# Altium project STM32F103.PrjPcb
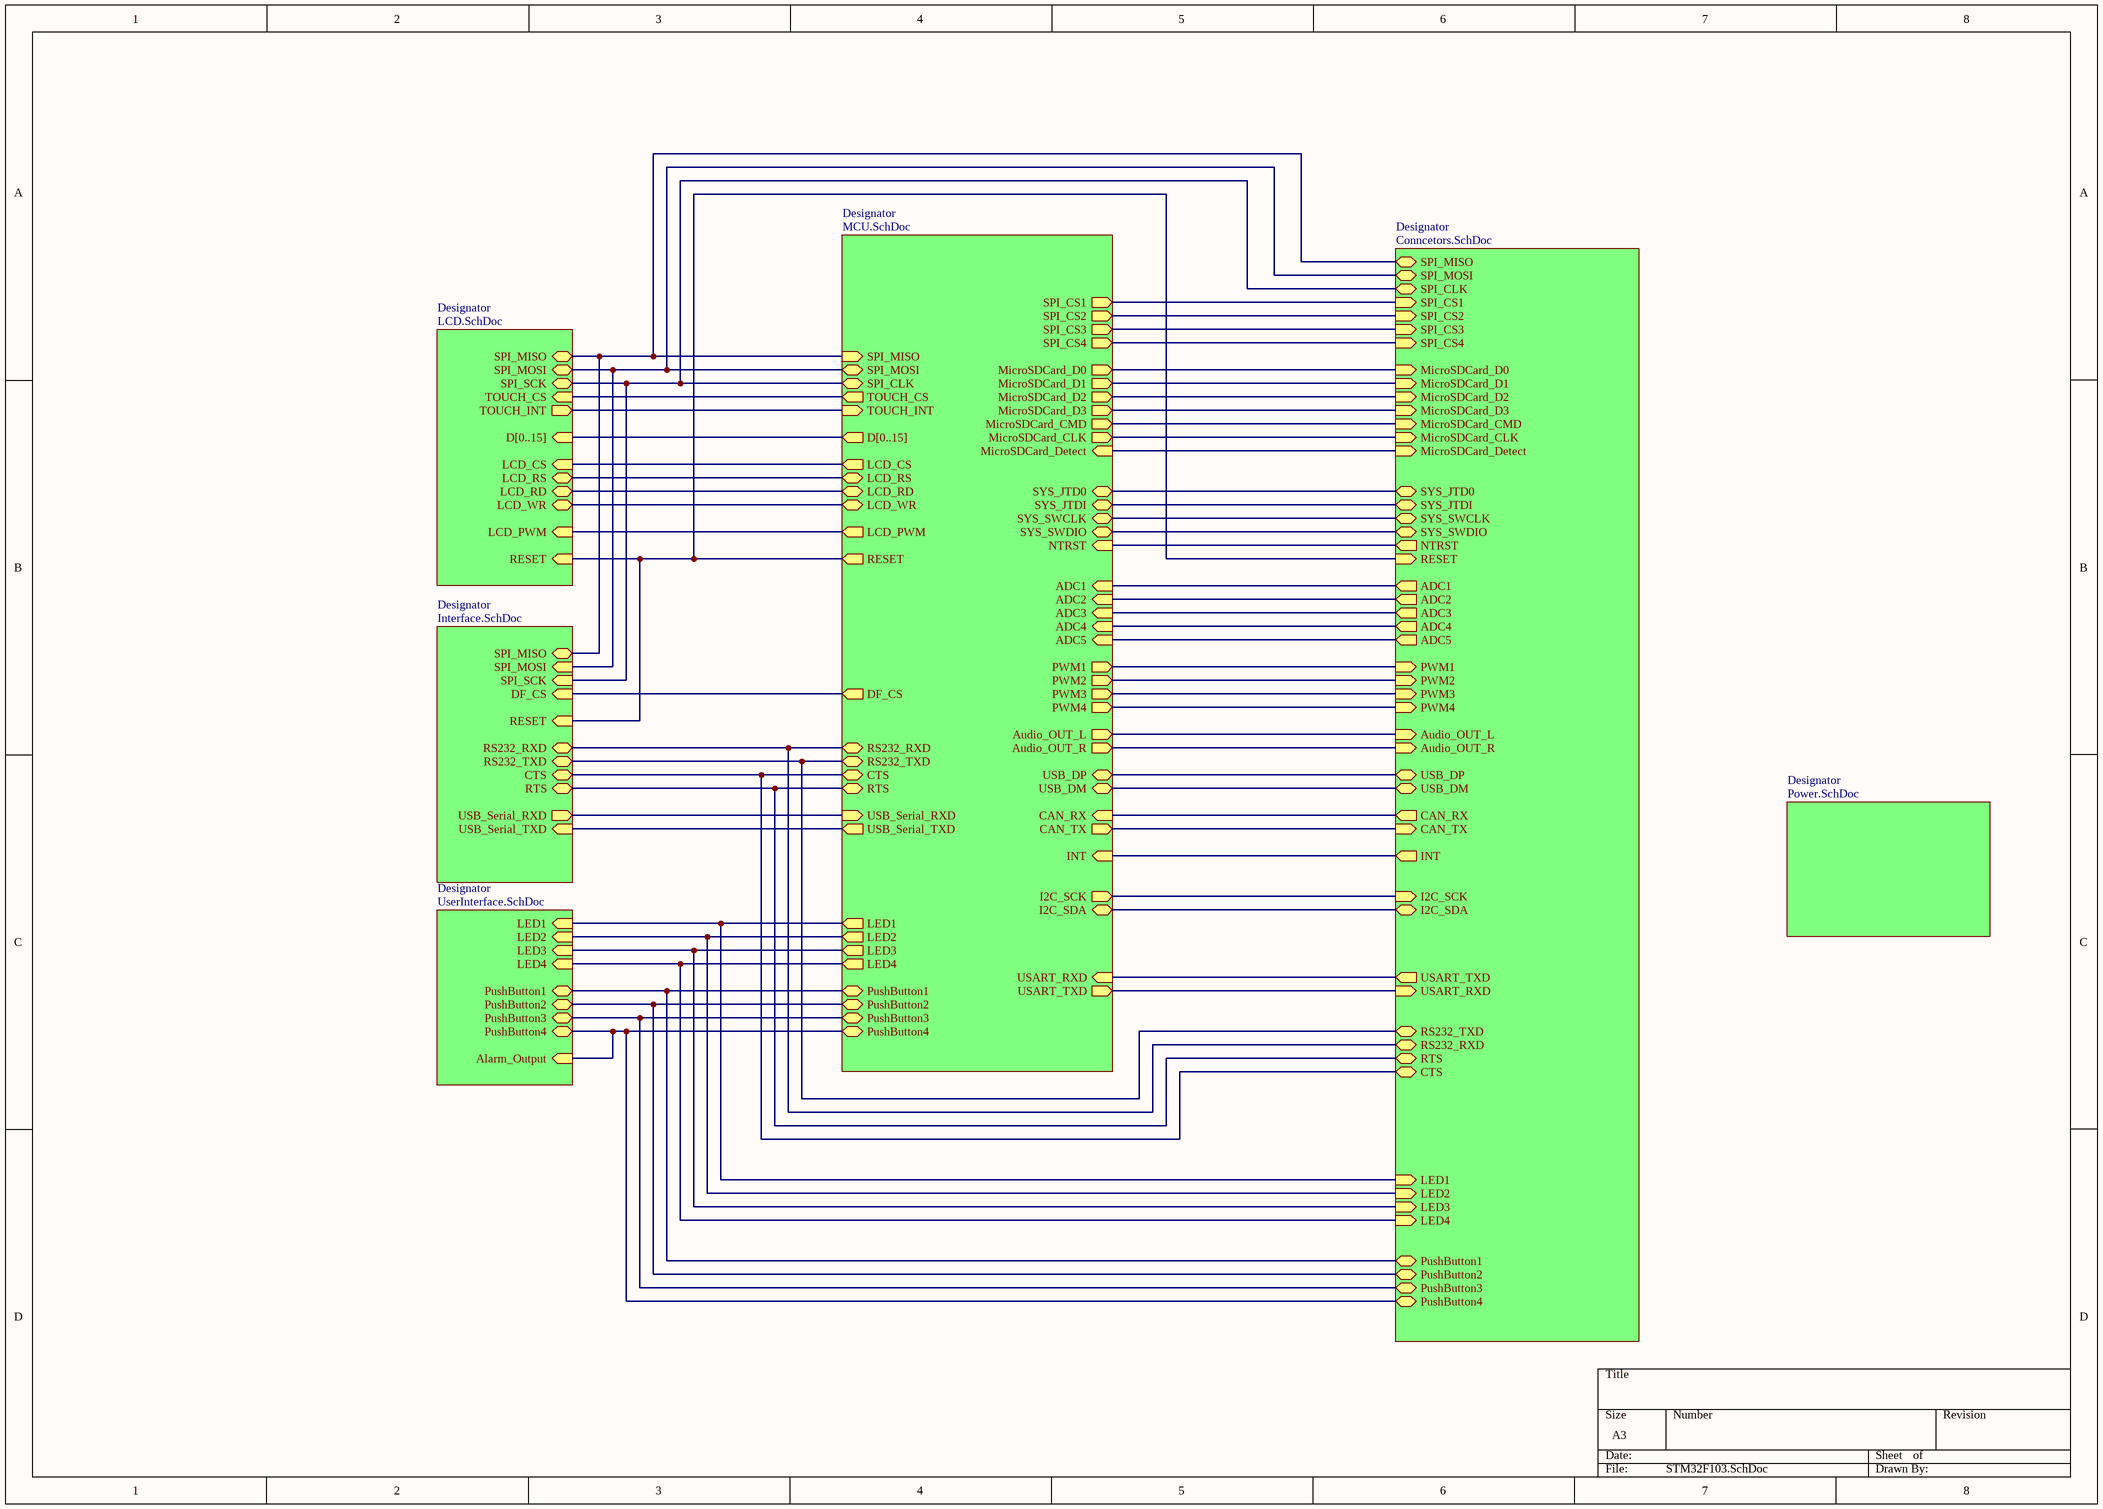
[diagram p0: STM32F103.SchDoc]
7 sheets, 148 parts. Net scope: hierarchical (ports join the sheet entries above them; power ports are global).
Board file: STM32F103.PcbDoc
Sheets:
  STM32F103.SchDoc
    Designator = MCU.SchDoc
    Designator = Power.SchDoc
    Designator = Conncetors.SchDoc
    Designator = Interface.SchDoc
    Designator = UserInterface.SchDoc
    Designator = LCD.SchDoc

## Sheet STM32F103.SchDoc
size A3

### Sub-sheets
Designator = MCU.SchDoc: D[0..15] (out), SPI_MISO (in), SPI_MOSI (bidir), SPI_CLK (bidir), TOUCH_CS (out), TOUCH_INT (in), LCD_CS (out), LCD_RS (bidir), LCD_RD (bidir), LCD_WR (bidir), LCD_PWM (out), RESET (out), DF_CS (out), RS232_RXD (bidir), RS232_TXD (bidir), CTS (bidir), RTS (bidir), USB_Serial_RXD (in), USB_Serial_TXD (out), LED1 (out), LED2 (out), LED3 (out), LED4 (out), PushButton1 (bidir), PushButton2 (bidir), PushButton3 (bidir), PushButton4 (bidir), I2C_SCK (out), I2C_SDA (bidir), USART_TXD (out), USART_RXD (in), INT (in), CAN_TX (out), CAN_RX (in), USB_DM (bidir), USB_DP (bidir), Audio_OUT_L (out), Audio_OUT_R (out), PWM1 (out), PWM2 (out), PWM3 (out), PWM4 (out), ADC1 (in), ADC2 (in), ADC3 (in), ADC4 (in), ADC5 (in), NTRST (in), SYS_SWDIO (bidir), SYS_SWCLK (bidir), SYS_JTDI (bidir), SYS_JTD0 (bidir), MicroSDCard_D0 (out), MicroSDCard_D1 (out), MicroSDCard_D2 (out), MicroSDCard_D3 (out), MicroSDCard_CMD (out), MicroSDCard_CLK (out), MicroSDCard_Detect (in), SPI_CS1 (out), SPI_CS2 (out), SPI_CS3 (out), SPI_CS4 (out)
Designator = Power.SchDoc: no entries
Designator = Conncetors.SchDoc: MicroSDCard_D0 (in), MicroSDCard_D1 (in), MicroSDCard_D2 (in), MicroSDCard_D3 (in), MicroSDCard_CMD (in), MicroSDCard_CLK (in), MicroSDCard_Detect (in), SYS_JTD0 (bidir), SYS_JTDI (bidir), SYS_SWCLK (bidir), SYS_SWDIO (bidir), NTRST (out), RESET (in), LED1 (in), LED2 (in), LED3 (in), LED4 (in), PushButton1 (bidir), PushButton2 (bidir), PushButton3 (bidir), PushButton4 (bidir), ADC1 (out), ADC2 (out), ADC3 (out), ADC4 (out), ADC5 (out), PWM1 (in), PWM2 (in), PWM3 (in), PWM4 (in), Audio_OUT_L (in), Audio_OUT_R (in), USB_DP (bidir), USB_DM (bidir), CAN_RX (out), CAN_TX (in), SPI_MISO (bidir), SPI_MOSI (bidir), SPI_CLK (bidir), SPI_CS1 (in), SPI_CS2 (in), SPI_CS3 (in), INT (out), USART_TXD (out), USART_RXD (in), RS232_RXD (bidir), RS232_TXD (bidir), RTS (bidir), CTS (bidir), SPI_CS4 (in), I2C_SDA (bidir), I2C_SCK (in)
Designator = Interface.SchDoc: SPI_MISO, SPI_MOSI (in), SPI_SCK (in), DF_CS (in), RESET (in), RS232_RXD (bidir), RS232_TXD (bidir), CTS (bidir), RTS (bidir), USB_Serial_RXD (out), USB_Serial_TXD (in)
Designator = UserInterface.SchDoc: LED1 (in), LED2 (in), LED3 (in), LED4 (in), PushButton1 (bidir), PushButton2 (bidir), PushButton3 (bidir), PushButton4 (bidir), Alarm_Output (in)
Designator = LCD.SchDoc: D[0..15] (in), LCD_CS (in), LCD_RS (bidir), LCD_RD (bidir), LCD_WR (bidir), RESET (in), LCD_PWM (in), SPI_MISO (bidir), SPI_MOSI (bidir), SPI_SCK (bidir), TOUCH_CS (in), TOUCH_INT (out)

### Nets
CS: sheet Designator/LCD_CS, sheet Designator/LCD_CS
INT: sheet Designator/TOUCH_INT, sheet Designator/TOUCH_INT
MISO: sheet Designator/SPI_MISO, sheet Designator/SPI_MISO, sheet Designator/SPI_MISO, sheet Designator/SPI_MISO
MOSI: sheet Designator/SPI_MOSI, sheet Designator/SPI_MOSI, sheet Designator/SPI_MOSI, sheet Designator/SPI_MOSI
PA0: sheet Designator/CTS, sheet Designator/CTS, sheet Designator/CTS
PA1: sheet Designator/RTS, sheet Designator/RTS, sheet Designator/RTS
PA2: sheet Designator/RS232_TXD, sheet Designator/RS232_TXD, sheet Designator/RS232_TXD
PA3: sheet Designator/RS232_RXD, sheet Designator/RS232_RXD, sheet Designator/RS232_RXD
PA4: sheet Designator/Audio_OUT_R, sheet Designator/Audio_OUT_R
PA5: sheet Designator/Audio_OUT_L, sheet Designator/Audio_OUT_L
PA6: sheet Designator/PWM1, sheet Designator/PWM1
PA7: sheet Designator/PWM2, sheet Designator/PWM2
PA8: sheet Designator/MicroSDCard_Detect, sheet Designator/MicroSDCard_Detect
PA9: sheet Designator/USB_Serial_TXD, sheet Designator/USB_Serial_TXD
PA10: sheet Designator/USB_Serial_RXD, sheet Designator/USB_Serial_RXD
PA11: sheet Designator/USB_DM, sheet Designator/USB_DM
PA12: sheet Designator/USB_DP, sheet Designator/USB_DP
PA13: sheet Designator/SYS_SWDIO, sheet Designator/SYS_SWDIO
PA14: sheet Designator/SYS_SWCLK, sheet Designator/SYS_SWCLK
PA15: sheet Designator/SYS_JTDI, sheet Designator/SYS_JTDI
PB0: sheet Designator/PWM3, sheet Designator/PWM3
PB1: sheet Designator/PWM4, sheet Designator/PWM4
PB2: sheet Designator/TOUCH_CS, sheet Designator/TOUCH_CS
PB3: sheet Designator/SYS_JTD0, sheet Designator/SYS_JTD0
PB4: sheet Designator/NTRST, sheet Designator/NTRST
PB5: sheet Designator/INT, sheet Designator/INT
PB6: sheet Designator/I2C_SCK, sheet Designator/I2C_SCK
PB7: sheet Designator/I2C_SDA, sheet Designator/I2C_SDA
PB8: sheet Designator/CAN_RX, sheet Designator/CAN_RX
PB9: sheet Designator/CAN_TX, sheet Designator/CAN_TX
PB10: sheet Designator/USART_TXD, sheet Designator/USART_RXD
PB11: sheet Designator/USART_RXD, sheet Designator/USART_TXD
PB12: sheet Designator/DF_CS, sheet Designator/DF_CS
PB13: sheet Designator/SPI_CLK, sheet Designator/SPI_CLK, sheet Designator/SPI_SCK, sheet Designator/SPI_SCK
PC0: sheet Designator/ADC1, sheet Designator/ADC1
PC1: sheet Designator/ADC2, sheet Designator/ADC2
PC2: sheet Designator/ADC3, sheet Designator/ADC3
PC3: sheet Designator/ADC4, sheet Designator/ADC4
PC4: sheet Designator/ADC5, sheet Designator/ADC5
PC6: sheet Designator/SPI_CS3, sheet Designator/SPI_CS3
PC7: sheet Designator/SPI_CS4, sheet Designator/SPI_CS4
PC8: sheet Designator/MicroSDCard_D0, sheet Designator/MicroSDCard_D0
PC9: sheet Designator/MicroSDCard_D1, sheet Designator/MicroSDCard_D1
PC10: sheet Designator/MicroSDCard_D2, sheet Designator/MicroSDCard_D2
PC11: sheet Designator/MicroSDCard_D3, sheet Designator/MicroSDCard_D3
PC12: sheet Designator/MicroSDCard_CLK, sheet Designator/MicroSDCard_CLK
PC13: sheet Designator/PushButton4, sheet Designator/PushButton4, sheet Designator/PushButton4, sheet Designator/Alarm_Output
PD2: sheet Designator/MicroSDCard_CMD, sheet Designator/MicroSDCard_CMD
PD3: sheet Designator/SPI_CS1, sheet Designator/SPI_CS1
PD4: sheet Designator/LCD_RD, sheet Designator/LCD_RD
PD5: sheet Designator/LCD_WR, sheet Designator/LCD_WR
PD6: sheet Designator/SPI_CS2, sheet Designator/SPI_CS2
PD11: sheet Designator/LCD_RS, sheet Designator/LCD_RS
PD12: sheet Designator/LCD_PWM, sheet Designator/LCD_PWM
PE0: sheet Designator/LED1, sheet Designator/LED1, sheet Designator/LED1
PE1: sheet Designator/LED2, sheet Designator/LED2, sheet Designator/LED2
PE2: sheet Designator/LED3, sheet Designator/LED3, sheet Designator/LED3
PE3: sheet Designator/LED4, sheet Designator/LED4, sheet Designator/LED4
PE4: sheet Designator/PushButton1, sheet Designator/PushButton1, sheet Designator/PushButton1
PE5: sheet Designator/PushButton2, sheet Designator/PushButton2, sheet Designator/PushButton2
PE6: sheet Designator/PushButton3, sheet Designator/PushButton3, sheet Designator/PushButton3
RESET: sheet Designator/RESET, sheet Designator/RESET, sheet Designator/RESET, sheet Designator/RESET

## Sheet MCU.SchDoc
size A4
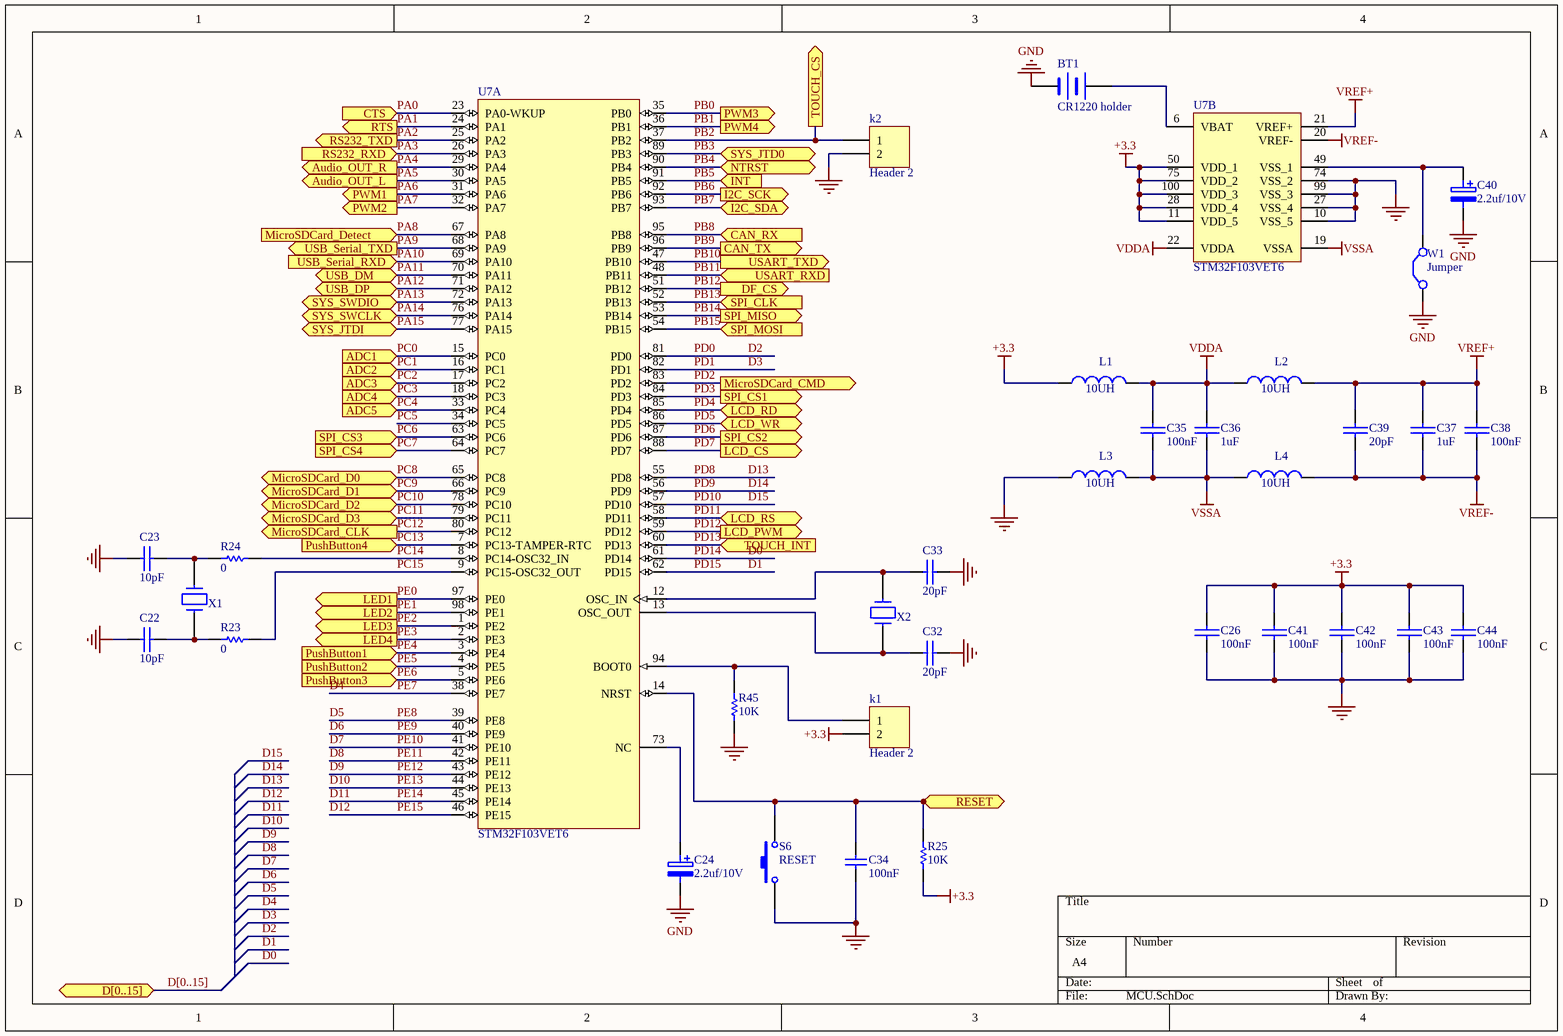
[diagram p1: MCU.SchDoc]

### Parts
BT1  CR1220 holder  [BAT]
C22  10pF  [1206]
C23  10pF  [1206]
C24  2.2uf/10V  [1210]
C26  100nF  [0805]
C32  20pF  [1206]
C33  20pF  [1206]
C34  100nF  [1206]
C35  100nF  [1206]
C36  1uF  [1206]
C37  1uF  [1206]
C38  100nF  [1206]
C39  20pF  [1206]
C40  2.2uf/10V  [1210]
C41  100nF  [0805]
C42  100nF  [0805]
C43  100nF  [0805]
C44  100nF  [0805]
k1  Header 2  [SIP2]
k2  Header 2  [SIP2]
L1  10UH  [L1206]
L2  10UH  [L1206]
L3  10UH  [L1206]
L4  10UH  [L1206]
R23  0  [R1206]
R24  0  [R1206]
R25  10K  [R1206]
R45  10K  [1206]
S6  RESET  [SWSMD]
U7  STM32F103VET6  [STM-LQFP100_N]  (parts A,B of 2)
W1  Jumper  [JP2_SMD]
X1  HC-49S-C16QSA-8M(jfvny)(with socket)  [Xtal1]  (value not drawn)
X2  HC-49S-C16QSA-8M(jfvny)(with socket)  [XTAL3]  (value not drawn)

### Ports
ADC1 (in), ADC2 (in), ADC3 (in), ADC4 (in), ADC5 (in), Audio_OUT_L (out), Audio_OUT_R (out), CAN_RX (in), CAN_TX (out), CTS (in), D[0..15] (bidir), DF_CS (out), I2C_SCK (out), I2C_SDA (bidir), INT (in), LCD_CS (out), LCD_PWM (out), LCD_RD (bidir), LCD_RS (bidir), LCD_WR (bidir), LED1 (out), LED2 (out), LED3 (out), LED4 (out), MicroSDCard_CLK (out), MicroSDCard_CMD (out), MicroSDCard_D0 (bidir), MicroSDCard_D1 (bidir), MicroSDCard_D2 (bidir), MicroSDCard_D3 (bidir), MicroSDCard_Detect (in), NTRST (bidir), PushButton1 (in), PushButton2 (in), PushButton3 (in), PushButton4 (in), PWM1 (out), PWM2 (out), PWM3 (out), PWM4 (out), RESET (bidir), RS232_RXD (in), RS232_TXD (out), RTS (out), SPI_CLK (in), SPI_CS1 (out), SPI_CS2 (out), SPI_CS3 (in), SPI_CS4 (in), SPI_MISO (out), SPI_MOSI (in), SYS_JTD0 (bidir), SYS_JTDI (bidir), SYS_SWCLK (bidir), SYS_SWDIO (bidir), TOUCH_CS (out), TOUCH_INT (in), USART_RXD (in), USART_TXD (out), USB_DM (bidir), USB_DP (bidir), USB_Serial_RXD (in), USB_Serial_TXD (out)

### Nets
+3.3: C26.2 C41.2 C42.2 C43.2 C44.2 k1.2 L1.1 R25.1 U7.11(VDD_5) U7.28(VDD_4) U7.50(VDD_1) U7.75(VDD_2) U7.100(VDD_3)
GND: BT1.2(-) C22.2 C23.2 C24.2 C26.1 C32.2 C33.2 C34.1 C40.2 C41.1 C42.1 C43.1 C44.1 k2.2 L3.1 R45.1 S6.1 U7.10(VSS_5) U7.27(VSS_4) U7.74(VSS_2) U7.99(VSS_3) W1.1(C1)
VDDA: C35.2 C36.2 L1.2 L2.1 U7.22(VDDA)
VREF+: C37.2 C38.2 C39.2 L2.2 U7.21(VREF+)
VREF-: C37.1 C38.1 C39.1 L4.2 U7.20(VREF-)
VSSA: C35.1 C36.1 L3.2 L4.1 U7.19(VSSA)
D0: U7.61(PD14)  [also labelled PD14]
D1: U7.62(PD15)  [also labelled PD15]
D2: U7.81(PD0)  [also labelled PD0]
D3: U7.82(PD1)  [also labelled PD1]
D4: U7.38(PE7)  [also labelled PE7]
D5: U7.39(PE8)  [also labelled PE8]
D6: U7.40(PE9)  [also labelled PE9]
D7: U7.41(PE10)  [also labelled PE10]
D8: U7.42(PE11)  [also labelled PE11]
D9: U7.43(PE12)  [also labelled PE12]
D10: U7.44(PE13)  [also labelled PE13]
D11: U7.45(PE14)  [also labelled PE14]
D12: U7.46(PE15)  [also labelled PE15]
D13: U7.55(PD8)  [also labelled PD8]
D14: U7.56(PD9)  [also labelled PD9]
D15: U7.57(PD10)  [also labelled PD10]
PA0: U7.23(PA0-WKUP) ; port CTS
PA1: U7.24(PA1) ; port RTS
PA2: U7.25(PA2) ; port RS232_TXD
PA3: U7.26(PA3) ; port RS232_RXD
PA4: U7.29(PA4) ; port Audio_OUT_R
PA5: U7.30(PA5) ; port Audio_OUT_L
PA6: U7.31(PA6) ; port PWM1
PA7: U7.32(PA7) ; port PWM2
PA8: U7.67(PA8) ; port MicroSDCard_Detect
PA9: U7.68(PA9) ; port USB_Serial_TXD
PA10: U7.69(PA10) ; port USB_Serial_RXD
PA11: U7.70(PA11) ; port USB_DM
PA12: U7.71(PA12) ; port USB_DP
PA13: U7.72(PA13) ; port SYS_SWDIO
PA14: U7.76(PA14) ; port SYS_SWCLK
PA15: U7.77(PA15) ; port SYS_JTDI
PB0: U7.35(PB0) ; port PWM3
PB1: U7.36(PB1) ; port PWM4
PB2: k2.1 U7.37(PB2) ; port TOUCH_CS
PB3: U7.89(PB3) ; port SYS_JTD0
PB4: U7.90(PB4) ; port NTRST
PB5: U7.91(PB5) ; port INT
PB6: U7.92(PB6) ; port I2C_SCK
PB7: U7.93(PB7) ; port I2C_SDA
PB8: U7.95(PB8) ; port CAN_RX
PB9: U7.96(PB9) ; port CAN_TX
PB10: U7.47(PB10) ; port USART_TXD
PB11: U7.48(PB11) ; port USART_RXD
PB12: U7.51(PB12) ; port DF_CS
PB13: U7.52(PB13) ; port SPI_CLK
PB14: U7.53(PB14) ; port SPI_MISO  [project net MISO]
PB15: U7.54(PB15) ; port SPI_MOSI  [project net MOSI]
PC0: U7.15(PC0) ; port ADC1
PC1: U7.16(PC1) ; port ADC2
PC2: U7.17(PC2) ; port ADC3
PC3: U7.18(PC3) ; port ADC4
PC4: U7.33(PC4) ; port ADC5
PC5: U7.34(PC5)
PC6: U7.63(PC6) ; port SPI_CS3
PC7: U7.64(PC7) ; port SPI_CS4
PC8: U7.65(PC8) ; port MicroSDCard_D0
PC9: U7.66(PC9) ; port MicroSDCard_D1
PC10: U7.78(PC10) ; port MicroSDCard_D2
PC11: U7.79(PC11) ; port MicroSDCard_D3
PC12: U7.80(PC12) ; port MicroSDCard_CLK
PC13: U7.7(PC13-TAMPER-RTC) ; port PushButton4
PC14: R24.2 U7.8(PC14-OSC32_IN)
PC15: R23.2 U7.9(PC15-OSC32_OUT)
PD2: U7.83(PD2) ; port MicroSDCard_CMD
PD3: U7.84(PD3) ; port SPI_CS1
PD4: U7.85(PD4) ; port LCD_RD
PD5: U7.86(PD5) ; port LCD_WR
PD6: U7.87(PD6) ; port SPI_CS2
PD7: U7.88(PD7) ; port LCD_CS  [project net CS]
PD11: U7.58(PD11) ; port LCD_RS
PD12: U7.59(PD12) ; port LCD_PWM
PD13: U7.60(PD13) ; port TOUCH_INT  [project net INT]
PE0: U7.97(PE0) ; port LED1
PE1: U7.98(PE1) ; port LED2
PE2: U7.1(PE2) ; port LED3
PE3: U7.2(PE3) ; port LED4
PE4: U7.3(PE4) ; port PushButton1
PE5: U7.4(PE5) ; port PushButton2
PE6: U7.5(PE6) ; port PushButton3
RESET: C34.2 R25.2 S6.2 U7.14(NRST) ; port RESET
NetBT1_1: BT1.1(+) U7.6(VBAT)
NetC22_1: C22.1 R23.1 X1.2
NetC23_1: C23.1 R24.1 X1.1
NetC24_1: C24.1 U7.73(NC)
NetC32_1: C32.1 U7.13(OSC_OUT) X2.2
NetC33_1: C33.1 U7.12(OSC_IN) X2.1
NetC40_1: C40.1 U7.49(VSS_1) W1.2(C2)
Netk1_1: k1.1 R45.2 U7.94(BOOT0)

### Buses and harness runs
bus D[0..15] = port D[0..15]

### Library data of the parts
BT1 = BATTERY
C22 C23 C26 C32 C33 C35-C39 C41-C44 = CAP: Capacitor
C24 C40 = ELECTRO2: Electrolytic Capacitor
C34 = CAP: Capacitor; Value: 100pF; Published: 8-Jun-2000; Revision: July-2002: Re-released for DXP Platform.; Publisher: Altium Limited
k1 k2 = Header 2: Header, 2-Pin; LatestRevisionDate: 17-Jul-2002; LatestRevisionNote: Re-released for DXP Platform.; Publisher: Altium Limited
L1-L4 = Inductor: Value: 100uH; Published: 8-Jun-2000; Revision: July-2002: Re-released for DXP Platform.; Publisher: Altium Limited
R23 R24 = Res1: Resistor; Value: 1K; Published: 8-Jun-2000; Revision: July-2002: Re-released for DXP Platform.; Publisher: Altium Limited
R25 R45 = res1: Resistor; Value: 1K; Published: 8-Jun-2000; Revision: July-2002: Re-released for DXP Platform.; Publisher: Altium Limited
S6 = SW-PB: Switch; Published: 24-Mar-1999; LatestRevisionDate: 17-Jul-2002; LatestRevisionNote: Re-released for DXP Platform.; PackageReference: SPST-2; Publisher: Altium Limited
U7 = STM32F103VET6: ARM Cortex-M3 32-bit MCU, 512 KB Flash, 64 KB Internal RAM, 80 I/Os, 100-pin LQFP, -40 to 85 degC, Tray; A/D Converter: 3x12-bit (16 Channel); D/A Converter: 2x12-bit (2 Channel); FLASH Size (Prog) (kB): 512; I/Os (High Current): 80; Internal RAM Size (kB): 64; Operating Frequency(F) (Processor speed) (MHz): 72; Supply Voltage(Vcc) min (V): 2; DatasheetVersion: Rev. 8; PackageVersion: Rev. 1, 06/2013; PackageReference: LQFP100; PackageDescription: 100-Pin Low Profile Quad Flat Package, 14 x 14 mm Body, 0.5 mm Pitch; Supplier 1: Digi-Key; Supplier Part Number 1: 497-6443-ND; Supplier 2: Farnell; Supplier Part Number 2: 1624141; Supplier 3: Newark; Supplier Part Number 3: 01P4104; Supplier 4: Newark; Supplier Part Number 4: 57P1260; Supplier 5: Mouser; Supplier Part Number 5: 511-STM32F103VET6; Core: ARM Cortex-M3; Packing: Tray; Mounting Technology: Surface Mount; PartNumber: STM32F103VET6; ComponentLink1Description: Manufacturer URL; ComponentLink1URL: http://www.st.com/web/en/home.html; ComponentLink2Description: Datasheet; ComponentLink2URL: http://www.st.com/st-web-ui/static/active/en/resource/technical/document/datasheet/CD00191185.pdf; ComponentLink3Description: Package Specification; ComponentLink3URL: http://www.st.com/st-web-ui/static/active/en/resource/technical/document/data_brief/DM00071938.pdf
W1 = Jumper: Jumper Wire; Published: 24-Mar-1999; LatestRevisionDate: 17-Jul-2002; LatestRevisionNote: Re-released for DXP Platform.; PackageReference: RAD-0.2; Publisher: Altium Limited
X1 X2 = CRYSTAL

## Sheet Power.SchDoc
size A4
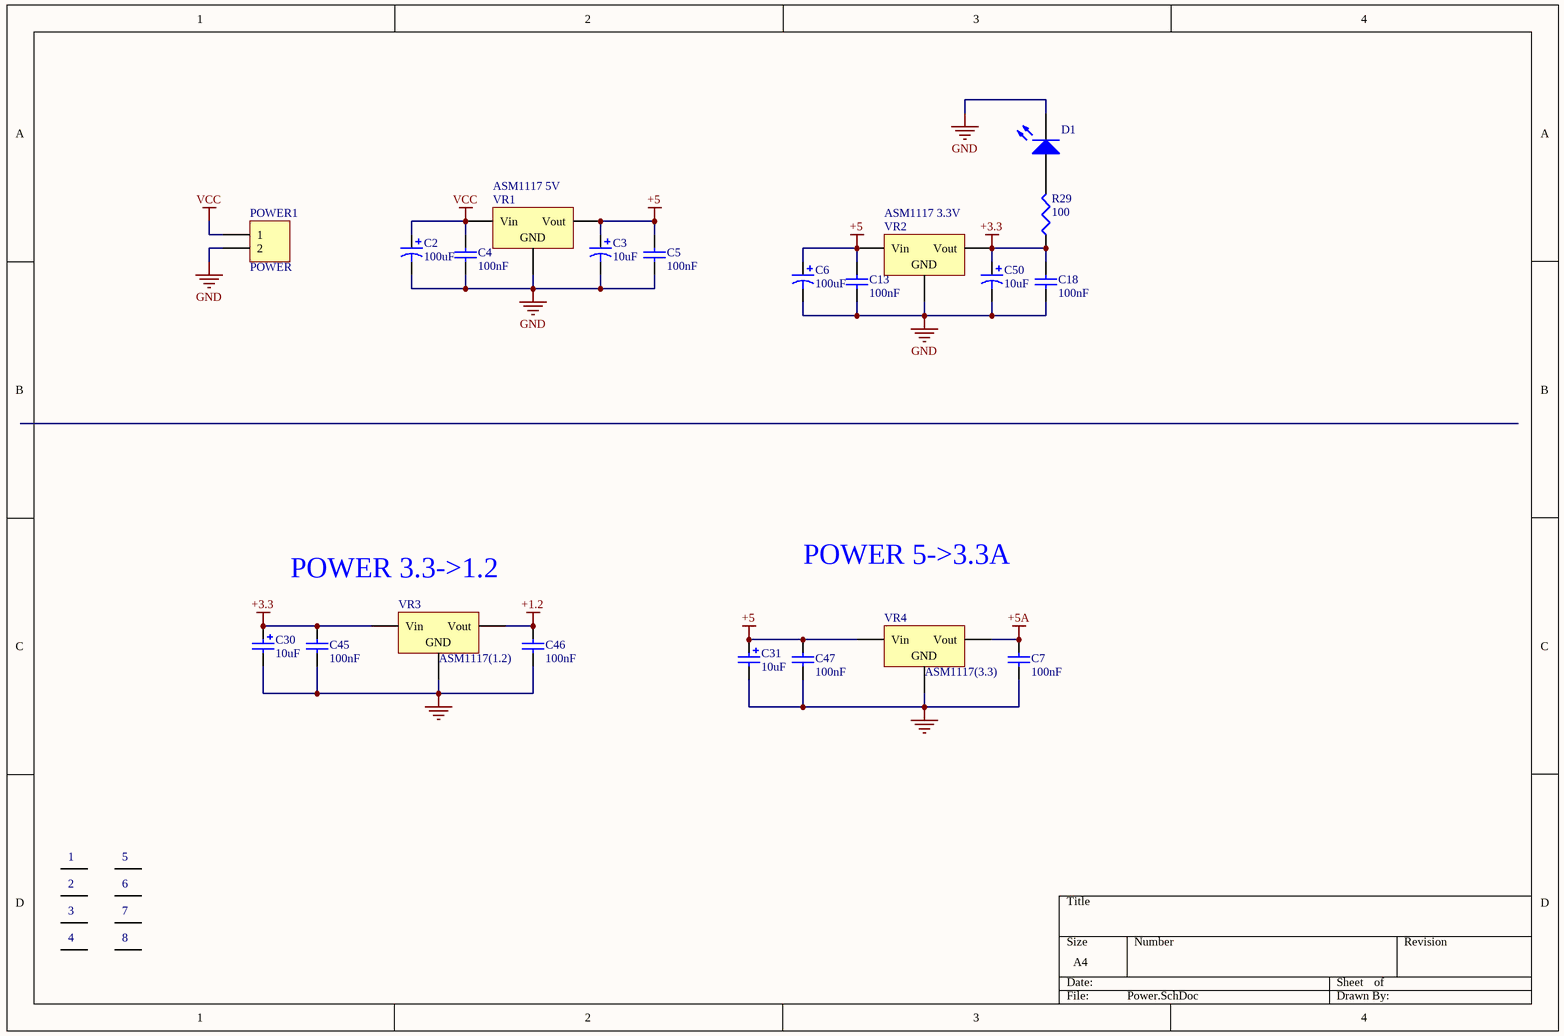
[diagram p2: Power.SchDoc]

### Parts
1  (no value)  [pad]
2  (no value)  [pad]
3  (no value)  [pad]
4  (no value)  [pad]
5  (no value)  [pad]
6  (no value)  [pad]
7  (no value)  [pad]
8  (no value)  [pad]
C2  100uf  [CAP470]
C3  10uf  [CAP1016]
C4  100nF  [1206]
C5  100nF  [1206]
C6  100uf  [CAP470]
C7  100nF  [1206]
C13  100nF  [1206]
C18  100nF  [1206]
C30  10uF  [CAP1016]
C31  10uF  [CAP1016]
C45  100nF  [1206]
C46  100nF  [1206]
C47  100nF  [1206]
C50  10uf  [CAP1016]
D1  LED0  [LED-0805]  (value not drawn)
POWER1  POWER  [power jack]
R29  100  [1206]
VR1  ASM1117 5V  [AMS117]
VR2  ASM1117 3.3V  [AMS117]
VR3  ASM1117(1.2)  [AMS117]
VR4  ASM1117(3.3)  [AMS117]

### Nets
+1.2: C46.1 VR3.4(Vout)
+3.3: C18.1 C30.1 C45.1 C50.1 R29.1 VR2.4(Vout) VR3.3(Vin)
+5: C3.1 C5.1 C6.1 C13.1 C31.1 C47.1 VR1.4(Vout) VR2.3(Vin) VR4.3(Vin)
+5A: C7.1 VR4.4(Vout)
GND: C2.2 C3.2 C4.2 C5.2 C6.2 C7.2 C13.2 C18.2 C30.2 C31.2 C45.2 C46.2 C47.2 C50.2 D1.2(K) POWER1.2 VR1.1(GND) VR2.1(GND) VR3.1(GND) VR4.1(GND)
VCC: C2.1 C4.1 POWER1.1 VR1.3(Vin)
NetD1_1: D1.1(A) R29.2

Not connected (* = marked no-connect by the designer): 1 1; 2 1; 3 1; 4 1; 5 1; 6 1; 7 1; 8 1

### Notes on the sheet
- POWER 3.3->1.2
- POWER 5->3.3A

### Library data of the parts
1-8 = PAD
C2 C3 C6 C30 C31 C50 = Cap Pol1: Polarized Capacitor (Radial); Published: 8-Jun-2000; Publisher: Altium Limited
  C2 C6: LatestRevisionDate: 17-Jul-2002; LatestRevisionNote: Re-released for DXP Platform.; PackageReference: RB7.6-15; Value: 100uF
  C3 C50: LatestRevisionDate: 17-Jul-2002; LatestRevisionNote: Re-released for DXP Platform.; PackageReference: RB7.6-15; Value: 10uF
  C30 C31: Revision: July-2002: Re-released for DXP Platform.; Value: 10uF
C4 C5 C13 C18 = Cap Semi: Capacitor (Semiconductor SIM Model); Published: 8-Jun-2000; LatestRevisionDate: 29-May-2009; LatestRevisionNote: IPC-7351 Footprint Added.; PackageReference: 0603C; Publisher: Altium Limited; PackageDescription: Chip Capacitor; Value: 100nF
C7 C45-C47 = Cap: Capacitor; Published: 8-Jun-2000; Revision: July-2002: Re-released for DXP Platform.; Publisher: Altium Limited; Value: 100nF
D1 = LED0: Typical INFRARED GaAs LED; Published: 8-Jun-2000; LatestRevisionDate: 08-Jul-2005; LatestRevisionNote: Mech Layer 1 removed.; PackageReference: LED-0; Publisher: Altium Limited
POWER1 = Header 2H: Header, 2-Pin, Right Angle; LatestRevisionDate: 17-Jul-2002; LatestRevisionNote: Re-released for DXP Platform.; Publisher: Altium Limited
R29 = Res3: Resistor; Published: 8-Jun-2000; LatestRevisionDate: 29-May-2009; LatestRevisionNote: IPC-7351 Footprint Added.; PackageReference: J1-0603; Publisher: Altium Limited; PackageDescription: Chip Resistor; Value: 100
VR1-VR4 = Volt Reg_1: Voltage Regulator; Published: 24-Mar-1999; LatestRevisionDate: 29-May-2009; LatestRevisionNote: IPC-7351 Footprint Added.; PackageReference: D2PAK; Publisher: Altium Limited; PackageDescription: 3-Pin Transistor Outline Package 2.54 mm Pitch, 15.1 mm Lead Span

## Sheet Conncetors.SchDoc
size A3
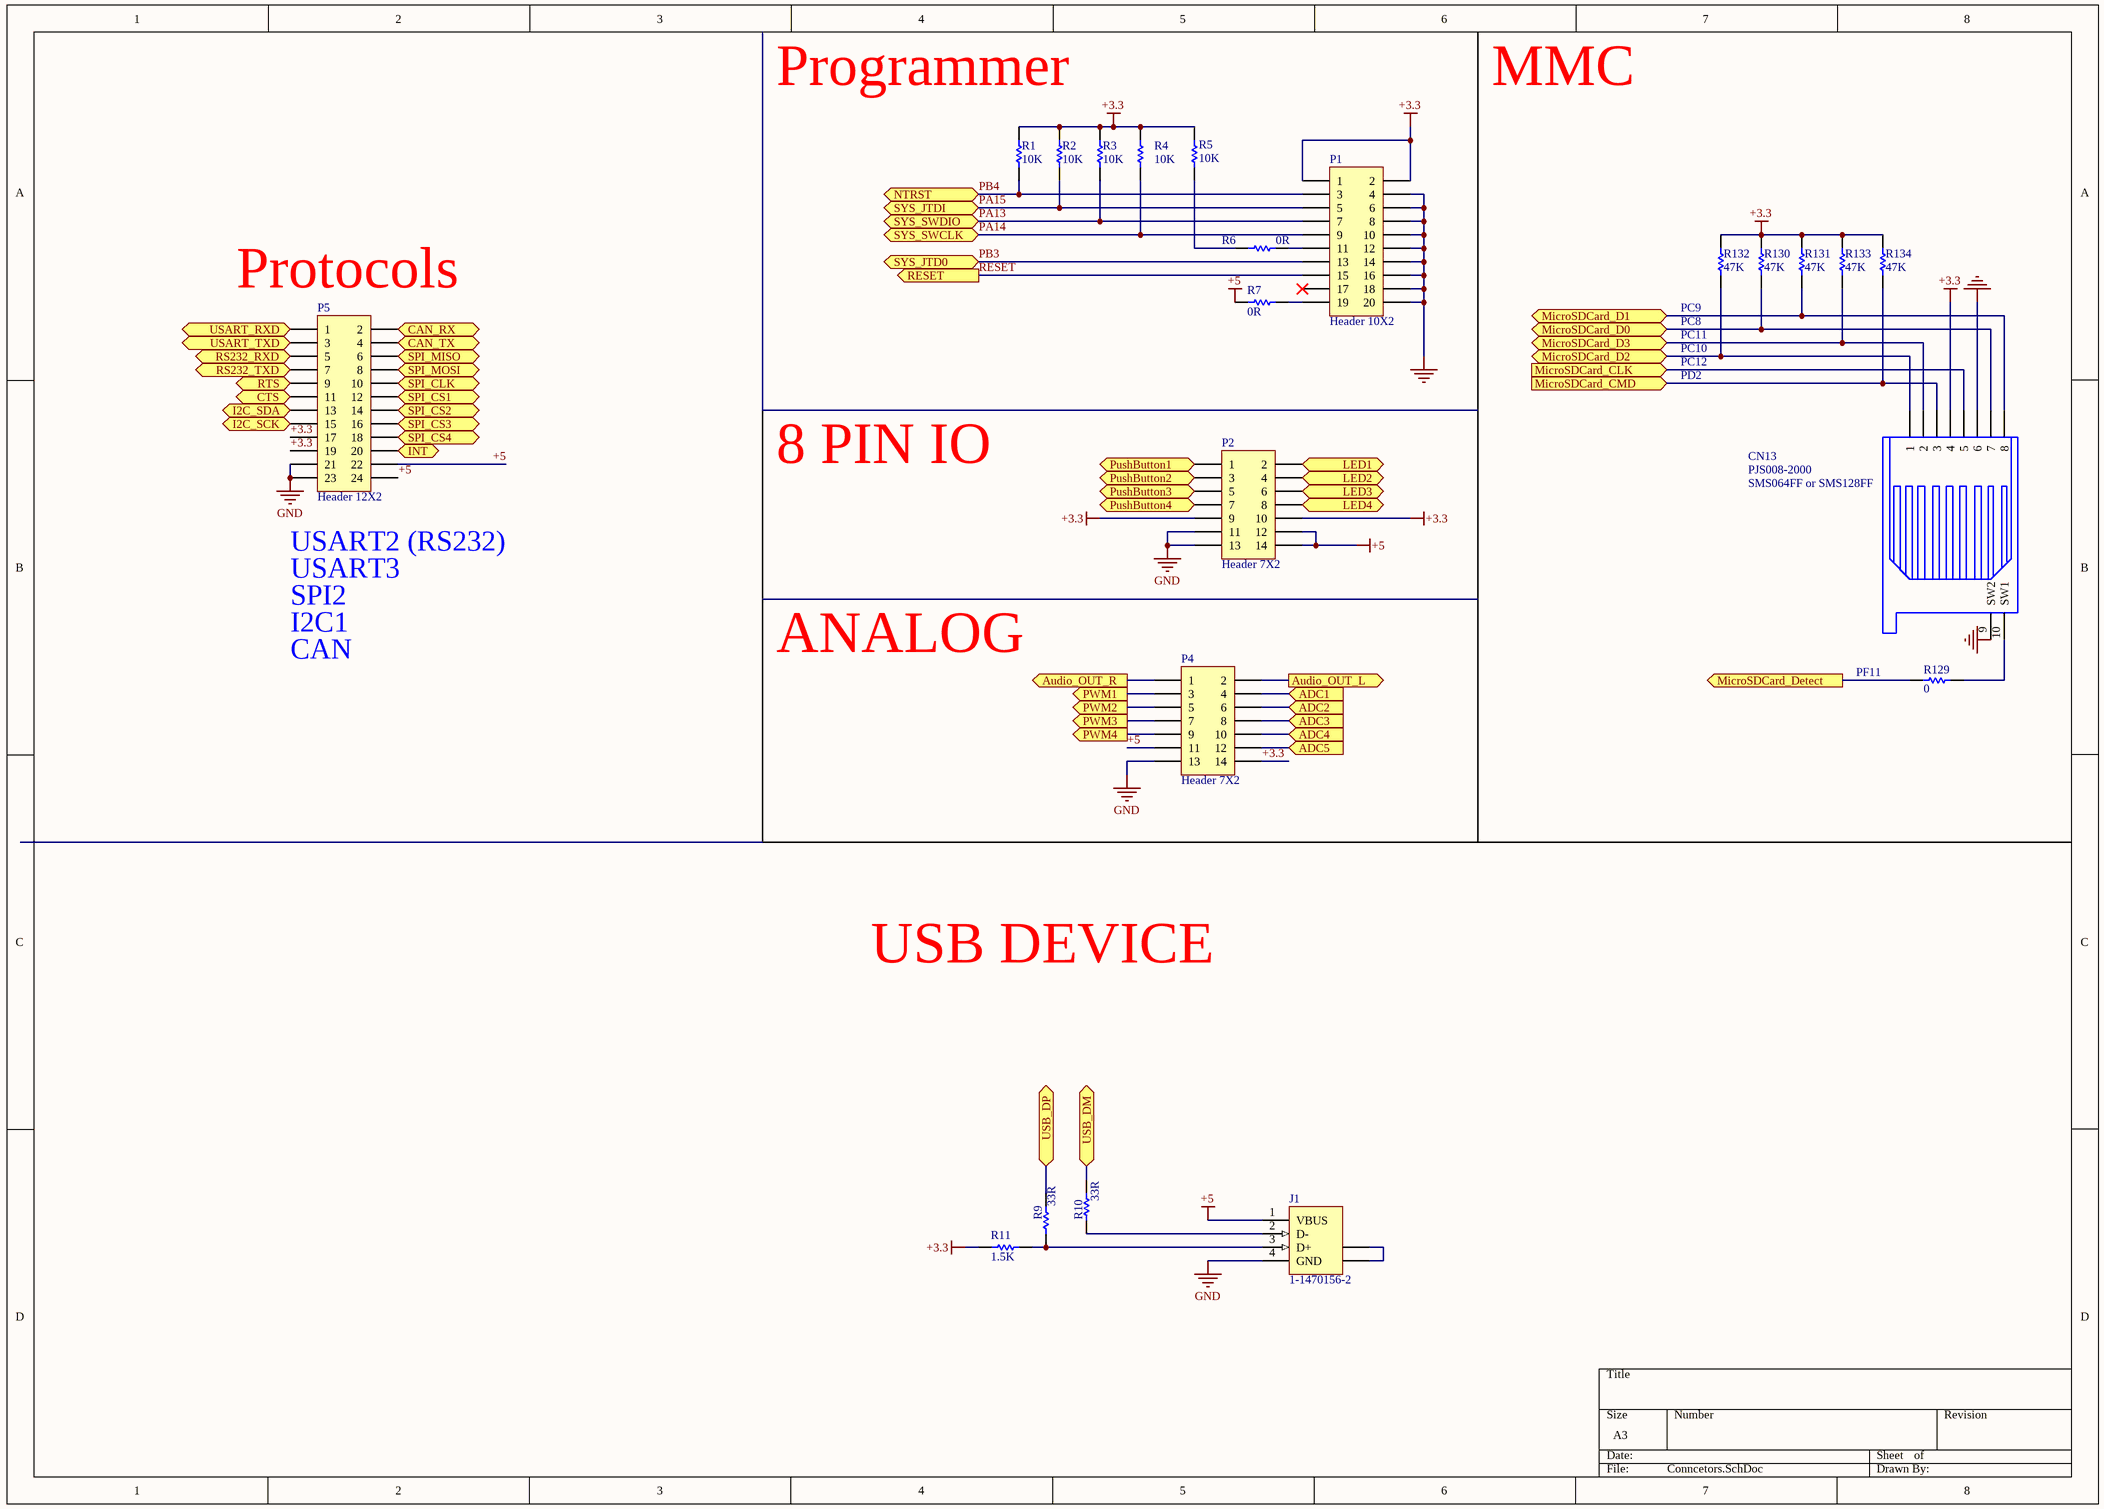
[diagram p3: Conncetors.SchDoc]

### Parts
CN13  PJS008-2000  [MicroSD_1]
J1  1-1470156-2  [440247]
P1  Header 10X2  [IDC20S]
P2  Header 7X2  [IDC14S]
P4  Header 7X2  [IDC14S]
P5  Header 12X2  [IDC24S]
R1  10K  [1206]
R2  10K  [1206]
R3  10K  [1206]
R4  10K  [1206]
R5  10K  [1206]
R6  0R  [1206]
R7  0R  [1206]
R9  33R  [1206]
R10  33R  [1206]
R11  1.5K  [1206]
R129  0  [R1206]
R130  47K  [R1206]
R131  47K  [R1206]
R132  47K  [R1206]
R133  47K  [R1206]
R134  47K  [R1206]

### Ports
ADC1 (in), ADC2 (in), ADC3 (in), ADC4 (in), ADC5 (in), Audio_OUT_L (out), Audio_OUT_R (out), CAN_RX (in), CAN_TX (out), CTS (in), I2C_SCK (bidir), I2C_SDA (bidir), INT (out), LED1 (bidir), LED2 (bidir), LED3 (bidir), LED4 (bidir), MicroSDCard_CLK (in), MicroSDCard_CMD (in), MicroSDCard_D0 (bidir), MicroSDCard_D1 (bidir), MicroSDCard_D2 (bidir), MicroSDCard_D3 (bidir), MicroSDCard_Detect (out), NTRST (bidir), PushButton1 (bidir), PushButton2 (bidir), PushButton3 (bidir), PushButton4 (bidir), PWM1 (out), PWM2 (out), PWM3 (out), PWM4 (out), RESET (out), RS232_RXD (in), RS232_TXD (out), RTS (out), SPI_CLK (in), SPI_CS1 (in), SPI_CS2 (in), SPI_CS3 (in), SPI_CS4 (in), SPI_MISO (out), SPI_MOSI (in), SYS_JTD0 (bidir), SYS_JTDI (bidir), SYS_SWCLK (bidir), SYS_SWDIO (bidir), USART_RXD (in), USART_TXD (out), USB_DM (bidir), USB_DP (bidir)

### Nets
+3.3: CN13.4 P1.1 P1.2 P2.9 P2.10 P4.14 P5.17 P5.19 R1.2 R2.2 R3.2 R4.2 R5.2 R11.1 R130.1 R131.1 R132.1 R133.1 R134.1
+5: J1.1(VBUS) P2.12 P2.14 P4.11 P5.22 P5.24 R7.2
GND: CN13.6 CN13.9(SW2) J1.4(GND) P1.4 P1.6 P1.8 P1.10 P1.12 P1.14 P1.16 P1.18 P1.20 P2.11 P2.13 P4.13 P5.21 P5.23
MISO: P5.6 ; port SPI_MISO
MOSI: P5.8 ; port SPI_MOSI
PA0: P5.11 ; port CTS
PA1: P5.9 ; port RTS
PA2: P5.7 ; port RS232_TXD
PA3: P5.5 ; port RS232_RXD
PA4: P4.1 ; port Audio_OUT_R
PA5: P4.2 ; port Audio_OUT_L
PA6: P4.3 ; port PWM1
PA7: P4.5 ; port PWM2
PA8: R129.1 ; port MicroSDCard_Detect
PA11: R10.1 ; port USB_DM
PA12: R9.1 ; port USB_DP
PA13: P1.7 R3.1 ; port SYS_SWDIO
PA14: P1.9 R4.1 ; port SYS_SWCLK
PA15: P1.5 R2.1 ; port SYS_JTDI
PB0: P4.7 ; port PWM3
PB1: P4.9 ; port PWM4
PB3: P1.13 ; port SYS_JTD0
PB4: P1.3 R1.1 ; port NTRST
PB5: P5.20 ; port INT
PB6: P5.15 ; port I2C_SCK
PB7: P5.13 ; port I2C_SDA
PB8: P5.2 ; port CAN_RX
PB9: P5.4 ; port CAN_TX
PB10: P5.1 ; port USART_RXD
PB11: P5.3 ; port USART_TXD
PB13: P5.10 ; port SPI_CLK
PC0: P4.4 ; port ADC1
PC1: P4.6 ; port ADC2
PC2: P4.8 ; port ADC3
PC3: P4.10 ; port ADC4
PC4: P4.12 ; port ADC5
PC6: P5.16 ; port SPI_CS3
PC7: P5.18 ; port SPI_CS4
PC8: CN13.7 R130.2 ; port MicroSDCard_D0
PC9: CN13.8 R131.2 ; port MicroSDCard_D1
PC10: CN13.1 R132.2 ; port MicroSDCard_D2
PC11: CN13.2 R133.2 ; port MicroSDCard_D3
PC12: CN13.5 ; port MicroSDCard_CLK
PC13: P2.7 ; port PushButton4
PD2: CN13.3 R134.2 ; port MicroSDCard_CMD
PD3: P5.12 ; port SPI_CS1
PD6: P5.14 ; port SPI_CS2
PE0: P2.2 ; port LED1
PE1: P2.4 ; port LED2
PE2: P2.6 ; port LED3
PE3: P2.8 ; port LED4
PE4: P2.1 ; port PushButton1
PE5: P2.3 ; port PushButton2
PE6: P2.5 ; port PushButton3
RESET: P1.15 ; port RESET
NetCN13_10: CN13.10(SW1) R129.2
NetJ1_2: J1.2(D-) R10.2
NetJ1_3: J1.3(D+) R9.2 R11.2
NetJ1_5: J1.5(SHLD) J1.6(SHLD)
NetP1_11: P1.11 R6.1
NetP1_19: P1.19 R7.1
NetR5_1: R5.1 R6.2

Not connected (* = marked no-connect by the designer): P1 17*

### Notes on the sheet
- Programmer
- MMC
- (near P5) Protocols
- (near R132) PC9
- (near R132) PC8
- PC10
- PC11
- PD2
- PC12
- 8 PIN IO
- (near CN13) SMS064FF or SMS128FF
- USART3
- (near P5) USART2 (RS232)
- SPI2
- I2C1
- CAN
- ANALOG
- PF11
- USB DEVICE

### Library data of the parts
CN13 = SMS016AFA5E
J1 = 1-1470156-2: USB 1.1, Right Angle, Thru-Hole, B Type, Receptacle, 4 Position, Black; ContactMaterial: Phosphor Bronze; ContactPlating: Gold over Nickel; TerminationLength: 3.00mm [0.118in.]; PCB_Layout: Complies with manufacturer's recommendation.; DrillSize: Corresponds to nominal value.; PanelGround: Without; Published: 15-Jul-2004; DatasheetDocument: 02-Jun-2001; PackageDocument: 02-Jun-2001; PackageReference: 1-1470156; Publisher: Altium Limited; HousingMaterial: Glass-Filled Thermoplastic; ComponentLink1Description: Manufacturer Link; ComponentLink1URL: http://www.tycoelectronics.com/; ComponentLink2Description: Packaging Specification; ComponentLink2URL: http://ecommas.tycoelectronics.com/commerce/DocumentDelivery/DDEController?Action=showdoc&DocId=Customer+Drawing%7F1470156%7FO%7Ftif%7FEnglish%7FC_1470156_O.tif
P1 = Header 10X2: Header, 10-Pin, Dual row; LatestRevisionDate: 17-Jul-2002; LatestRevisionNote: Re-released for DXP Platform.; Publisher: Altium Limited
P2 P4 = Header 7X2: Header, 7-Pin, Dual row; LatestRevisionDate: 17-Jul-2002; LatestRevisionNote: Re-released for DXP Platform.; Publisher: Altium Limited
P5 = Header 12X2: Header, 12-Pin, Dual row; LatestRevisionDate: 17-Jul-2002; LatestRevisionNote: Re-released for DXP Platform.; Publisher: Altium Limited
R1-R7 R129-R134 = Res1: Resistor; Value: 1K; Published: 8-Jun-2000; Revision: July-2002: Re-released for DXP Platform.; Publisher: Altium Limited
R9-R11 = Res1: Resistor; Value: 10K; Published: 8-Jun-2000; LatestRevisionDate: 17-Jul-2002; LatestRevisionNote: Re-released for DXP Platform.; PackageReference: AXIAL-0.3; Publisher: Altium Limited; PackageDescription: Axial Device, Thru-Hole; 2 Leads; 0.3 in Pin Spacing

## Sheet Interface.SchDoc
size A3
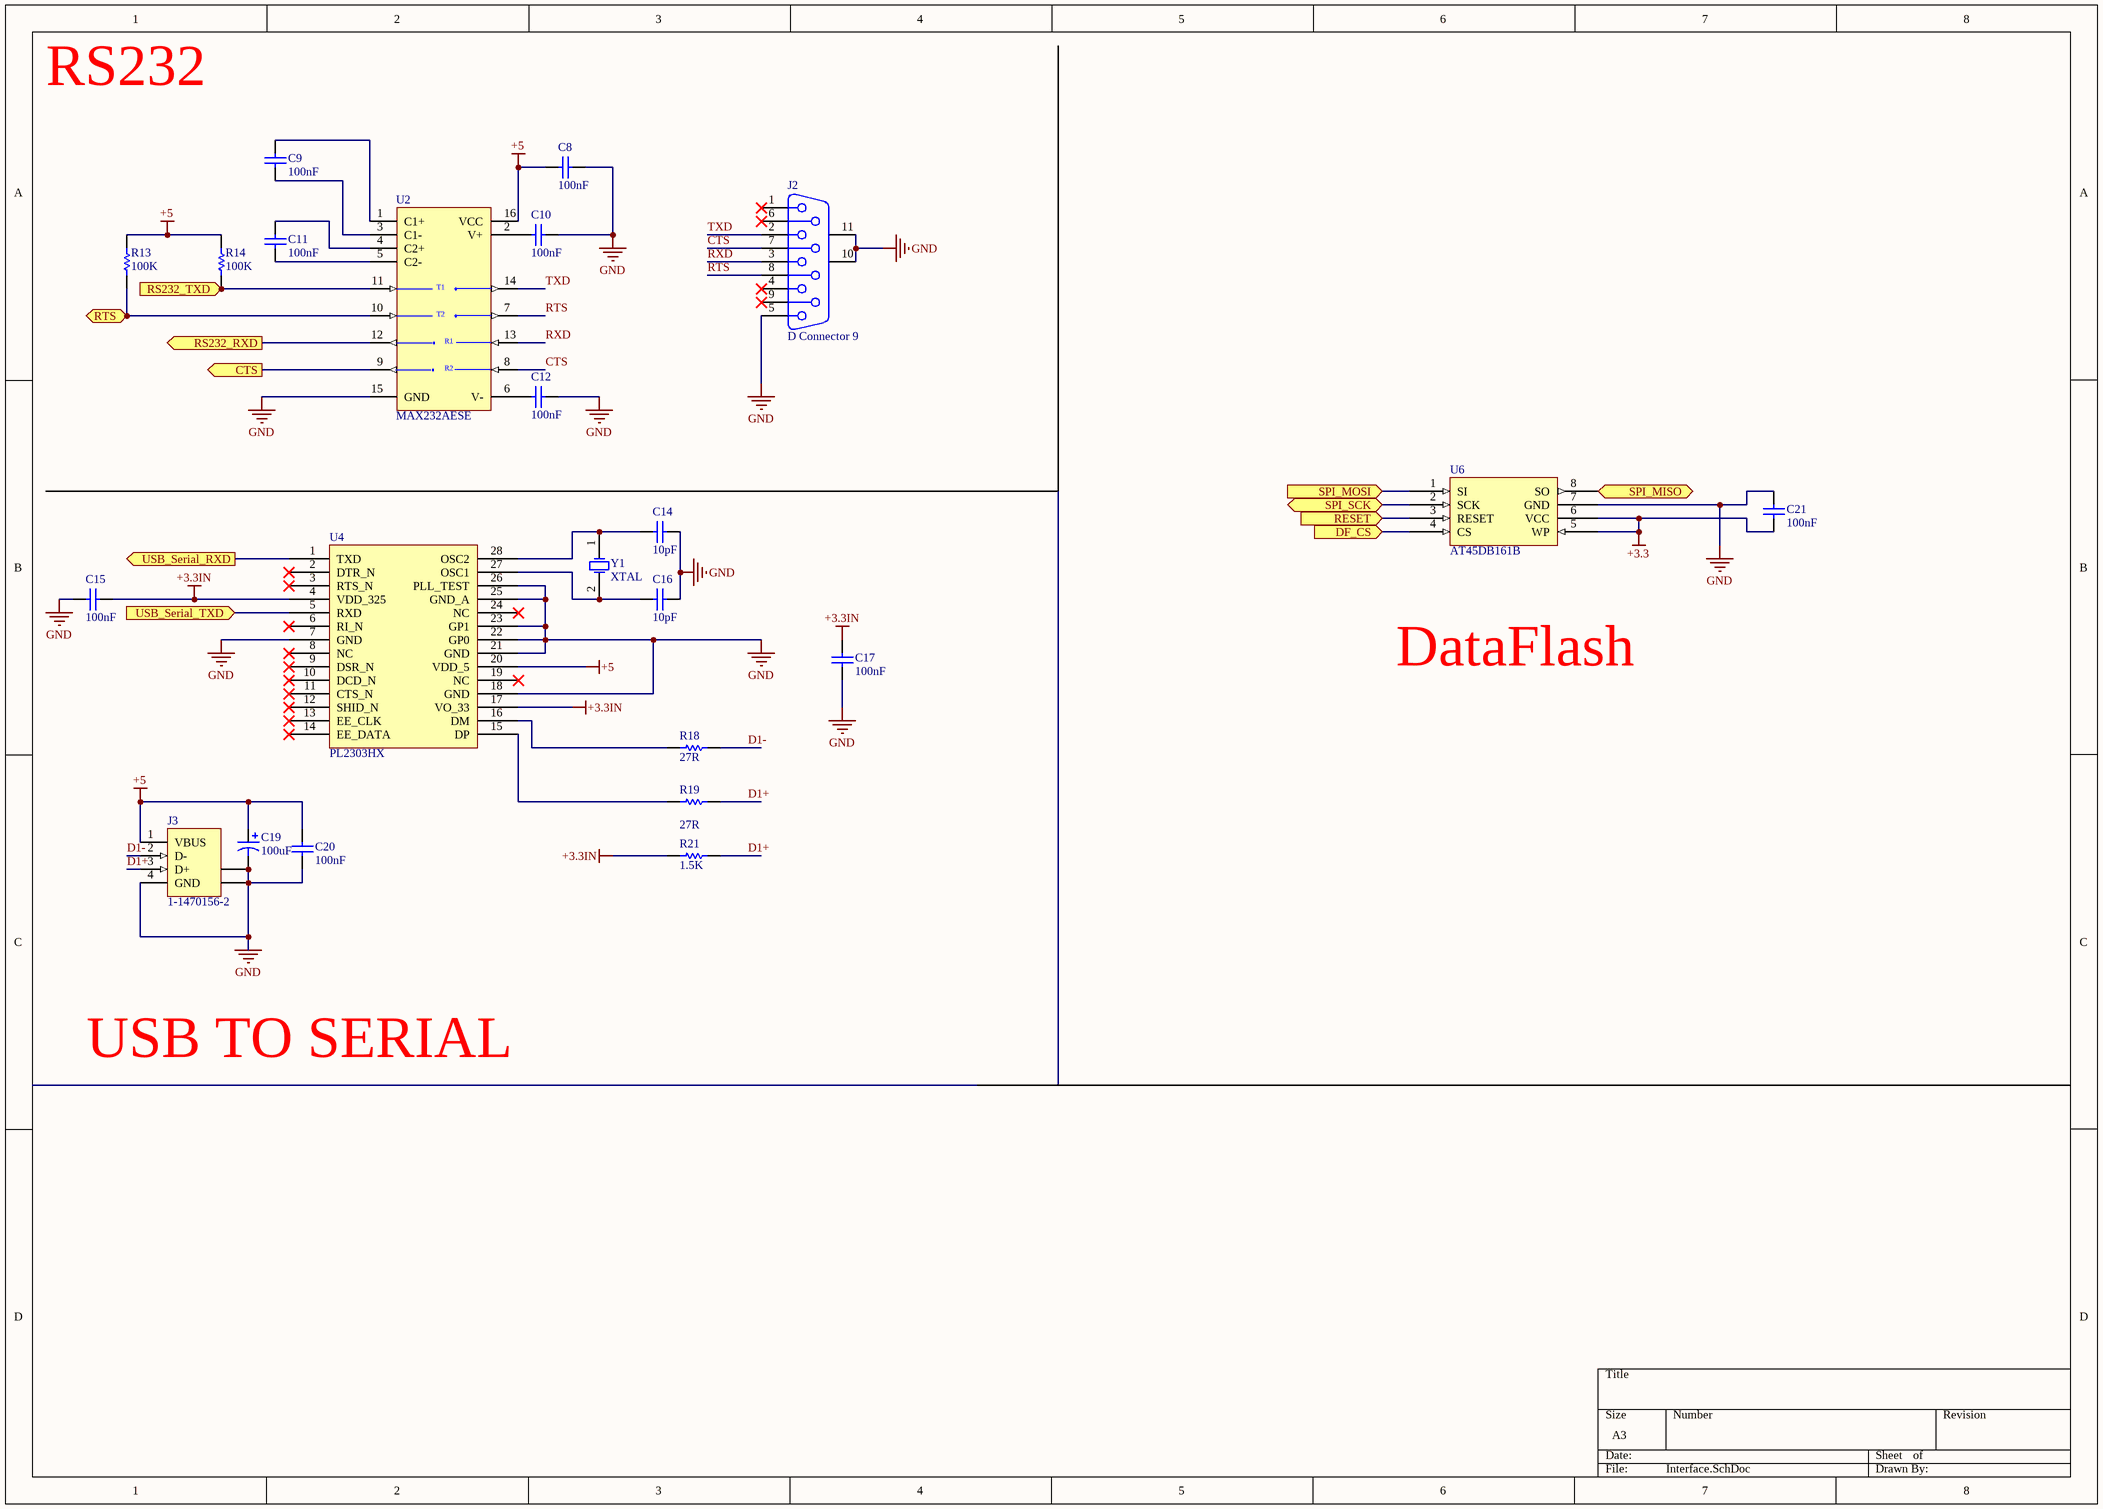
[diagram p4: Interface.SchDoc]

### Parts
C8  100nF  [1206]
C9  100nF  [1206]
C10  100nF  [1206]
C11  100nF  [1206]
C12  100nF  [1206]
C14  10pF  [1206]
C15  100nF  [1206]
C16  10pF  [1206]
C17  100nF  [1206]
C19  100uF  [CAP470]
C20  100nF  [1206]
C21  100nF  [1206]
J2  D Connector 9  [DSUB1.385-2H9]
J3  1-1470156-2  [440247]
R13  100K  [1206]
R14  100K  [1206]
R18  value 27R  [1206]  (hidden comment: 27)
R19  value 27R  [1206]  (hidden comment: 27)
R21  1.5k  [1206]
U2  MAX232AESE  [NSO16_L]
U4  PL2303HX  [SSOP-SS28_M]
U6  AT45DB161B  [SOP8]
Y1  XTAL  [XTAL3]

### Ports
CTS (out), DF_CS (in), RESET (in), RS232_RXD (out), RS232_TXD (in), RTS (in), SPI_MISO (out), SPI_MOSI (in), SPI_SCK (bidir), USB_Serial_RXD (out), USB_Serial_TXD (in)

### Nets
+3.3: C21.1 U6.5(WP) U6.6(VCC)
+3.3IN: C15.2 C17.2 R21.2 U4.4(VDD_325) U4.17(VO_33)
+5: C8.2 C19.1 C20.2 J3.1(VBUS) R13.1 R14.1 U2.16(VCC) U4.20(VDD_5)
GND: C8.1 C10.1 C12.1 C14.1 C15.1 C16.1 C17.1 C19.2 C20.1 C21.2 J2.5 J2.10(MH1) J2.11(MH2) J3.4(GND) J3.5(SHLD) J3.6(SHLD) U2.15(GND) U4.7(GND) U4.18(GND) U4.21(GND) U4.22(GP0) U4.23(GP1) U4.25(GND_A) U4.26(PLL_TEST) U6.7(GND)
CTS: J2.7 U2.8(R2IN)
D1+: J3.3(D+) R19.2 R21.1
D1-: J3.2(D-) R18.1
MISO: U6.8(SO) ; port SPI_MISO
MOSI: U6.1(SI) ; port SPI_MOSI
PA0: U2.9(R2OUT) ; port CTS
PA1: R13.2 U2.10(T2IN) ; port RTS
PA2: R14.2 U2.11(T1IN) ; port RS232_TXD
PA3: U2.12(R1OUT) ; port RS232_RXD
PA9: U4.5(RXD) ; port USB_Serial_TXD
PA10: U4.1(TXD) ; port USB_Serial_RXD
PB12: U6.4(CS) ; port DF_CS
PB13: U6.2(SCK) ; port SPI_SCK
RESET: U6.3(RESET) ; port RESET
RTS: J2.8 U2.7(T2OUT)
RXD: J2.3 U2.13(R1IN)
TXD: J2.2 U2.14(T1OUT)
NetC9_1: C9.1 U2.3(C1-)
NetC9_2: C9.2 U2.1(C1+)
NetC10_2: C10.2 U2.2(V+)
NetC11_1: C11.1 U2.5(C2-)
NetC11_2: C11.2 U2.4(C2+)
NetC12_2: C12.2 U2.6(V-)
NetC14_2: C14.2 U4.28(OSC2) Y1.1(OSC1)
NetC16_2: C16.2 U4.27(OSC1) Y1.2(OSC2)
NetR18_2: R18.2 U4.16(DM)
NetR19_1: R19.1 U4.15(DP)

Not connected (* = marked no-connect by the designer): J2 1* 4* 6* 9*; U4 2(DTR_N)* 3(RTS_N)* 6(RI_N)* 8(NC)* 9(DSR_N)* 10(DCD_N)* 11(CTS_N)* 12(SHID_N)* 13(EE_CLK)* 14(EE_DATA)* 19(NC)* 24(NC)*

### Notes on the sheet
- RS232
- DataFlash
- USB TO SERIAL
- (in symbol MAX232AESE) T1; T2; R1; R2

### Library data of the parts
C8-C12 C14-C17 C20 C21 = Cap: Capacitor; Value: 100pF; Published: 8-Jun-2000; LatestRevisionDate: 17-Jul-2002; LatestRevisionNote: Re-released for DXP Platform.; PackageReference: RAD-0.3; Publisher: Altium Limited; PackageDescription: Radial Cap, Thru-Hole; 2 Leads; 0.3 in Pin Spacing
C19 = Cap Pol1: Polarized Capacitor (Radial); Published: 8-Jun-2000; LatestRevisionDate: 17-Jul-2002; LatestRevisionNote: Re-released for DXP Platform.; PackageReference: RB7.6-15; Publisher: Altium Limited; PackageDescription: Polarized Capacitor (Radial); 2 Leads; Value: 100uF
J2 = D Connector 9: Receptacle Assembly, 9 Position, Right Angle; PackageDocument: O; Positions: 9; Published: 15-Jun-2001; LatestRevisionDate: 17-Jul-2002; LatestRevisionNote: Re-released for DXP Platform.; DatasheetDocument: 1-Sep-1999; PackageReference: 788750; Publisher: Altium Limited; Orientation: Right Angle; Gender: Receptacle
J3 = 1-1470156-2: as J1 on sheet Conncetors; Published: 15-Jul-2004; DatasheetDocument: 02-Jun-2001; PackageDocument: 02-Jun-2001; PackageReference: 1-1470156; Publisher: Altium Limited; HousingMaterial: Glass-Filled Thermoplastic; ComponentLink1Description: Manufacturer Link; ComponentLink1URL: http://www.tycoelectronics.com/; ComponentLink2Description: Packaging Specification; ComponentLink2URL: http://ecommas.tycoelectronics.com/commerce/DocumentDelivery/DDEController?Action=showdoc&DocId=Customer+Drawing%7F1470156%7FO%7Ftif%7FEnglish%7FC_1470156_O.tif
R13 R14 = Res1: Resistor; Value: 1K; Published: 8-Jun-2000; Revision: July-2002: Re-released for DXP Platform.; Publisher: Altium Limited
R18 R19 R21 = Res1: Resistor; Published: 8-Jun-2000; LatestRevisionDate: 17-Jul-2002; LatestRevisionNote: Re-released for DXP Platform.; PackageReference: AXIAL-0.3; Publisher: Altium Limited
  R21: Value: 1.5K
U2 = MAX232AESE: +5V-Powered, Multichannel RS-232 Driver/Receiver; Published: 16-Jan-2001; LatestRevisionDate: 13-Apr-2006; LatestRevisionNote: IPC-7351 Footprint Added.; DatasheetVersion: Nov-1997; PackageReference: NSO16; Publisher: Altium Limited; PackageDescription: 16-Pin Small Outline Integrated Circuit 1.27 mm Pitch; Code_JEDEC: MS-012-AC; Code_IPC: SOIC127P600-16; ComponentLink1Description: Manufacturer Link; ComponentLink1URL: http://www.maxim-ic.com/; ComponentLink2Description: Datasheet; ComponentLink2URL: http://pdfserv.maxim-ic.com/en/ds/MAX220-MAX249.pdf
U4 = PL2303
Y1 = XTAL: Crystal Oscillator; Published: 8-Jun-2000; LatestRevisionDate: 17-Jul-2002; LatestRevisionNote: Re-released for DXP Platform.; PackageReference: R38; Publisher: Altium Limited; PackageDescription: Crystal, Thru-Hole; 2 Leads; Body 3.1 x 8.2 mm (Dia.xH)

## Sheet UserInterface.SchDoc
size A4
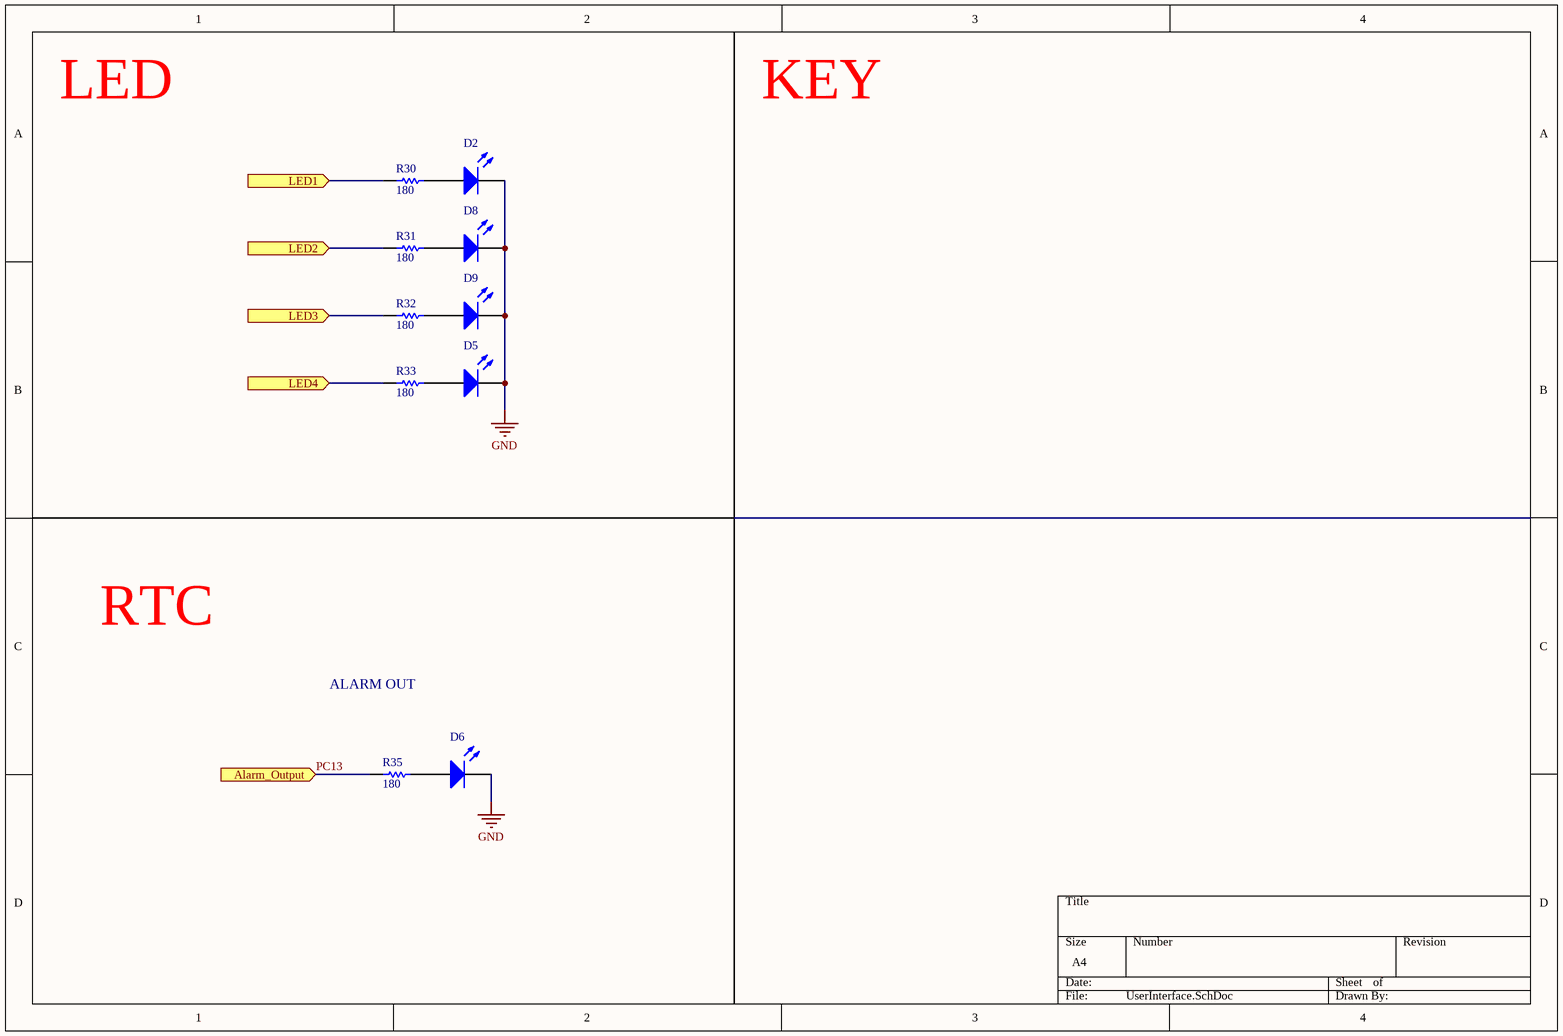
[diagram p5: UserInterface.SchDoc]

### Parts
D2  LED3  [LED-1206]  (value not drawn)
D5  LED3  [LED-1206]  (value not drawn)
D6  LED3  [LED-1206]  (value not drawn)
D8  LED3  [LED-1206]  (value not drawn)
D9  LED3  [LED-1206]  (value not drawn)
R30  180  [1206]
R31  180  [1206]
R32  180  [1206]
R33  180  [1206]
R35  180  [1206]

### Ports
Alarm_Output (in), LED1 (in), LED2 (in), LED3 (in), LED4 (in)

### Nets
GND: D2.2(K) D5.2(K) D6.2(K) D8.2(K) D9.2(K)
PC13: R35.1 ; port Alarm_Output
PE0: R30.1 ; port LED1
PE1: R31.1 ; port LED2
PE2: R32.1 ; port LED3
PE3: R33.1 ; port LED4
NetD2_1: D2.1(A) R30.2
NetD5_1: D5.1(A) R33.2
NetD6_1: D6.1(A) R35.2
NetD8_1: D8.1(A) R31.2
NetD9_1: D9.1(A) R32.2

### Notes on the sheet
- LED
- KEY
- RTC
- ALARM OUT

### Library data of the parts
D2 D5 D6 D8 D9 = LED3: Typical BLUE SiC LED; Published: 8-Jun-2000; LatestRevisionDate: 17-Dec-2003; LatestRevisionNote: PCB Footprint replaced.; DatasheetVersion: 16-Apr-2002; PackageVersion: 16-Apr-2002; PackageReference: 3.5X2.8X1.9; Publisher: Altium Limited
R30-R33 R35 = Res Semi: Semiconductor Resistor; Value: 27; Published: 8-Jun-2000; LatestRevisionDate: 17-Jul-2002; LatestRevisionNote: Re-released for DXP Platform.; PackageReference: AXIAL-0.5; Publisher: Altium Limited

## Sheet LCD.SchDoc
size C
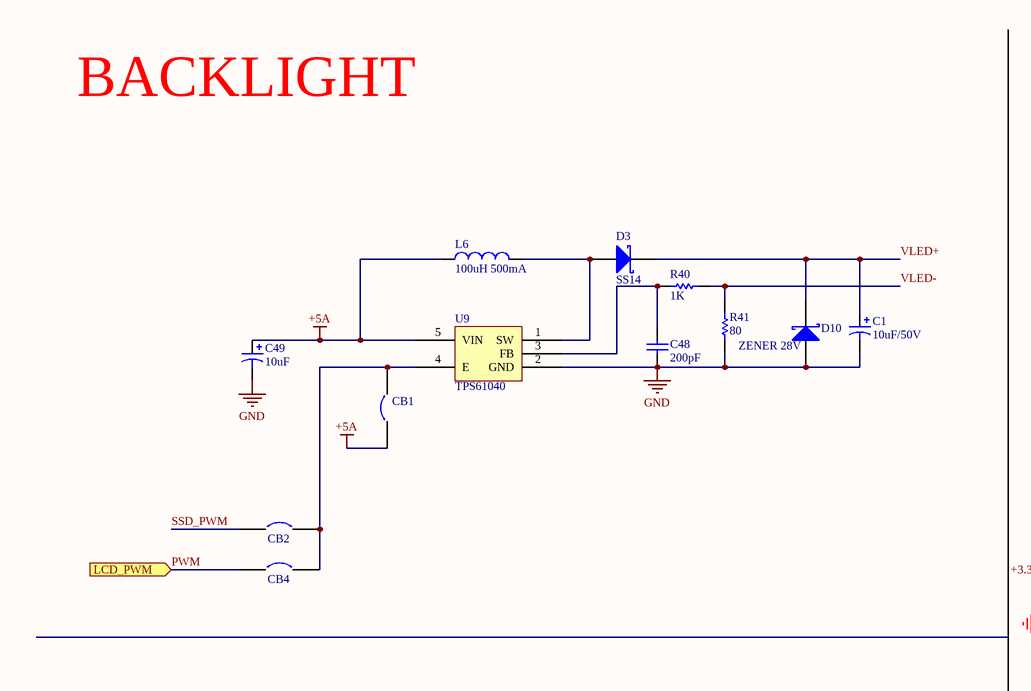
[diagram p6: LCD.SchDoc, left]
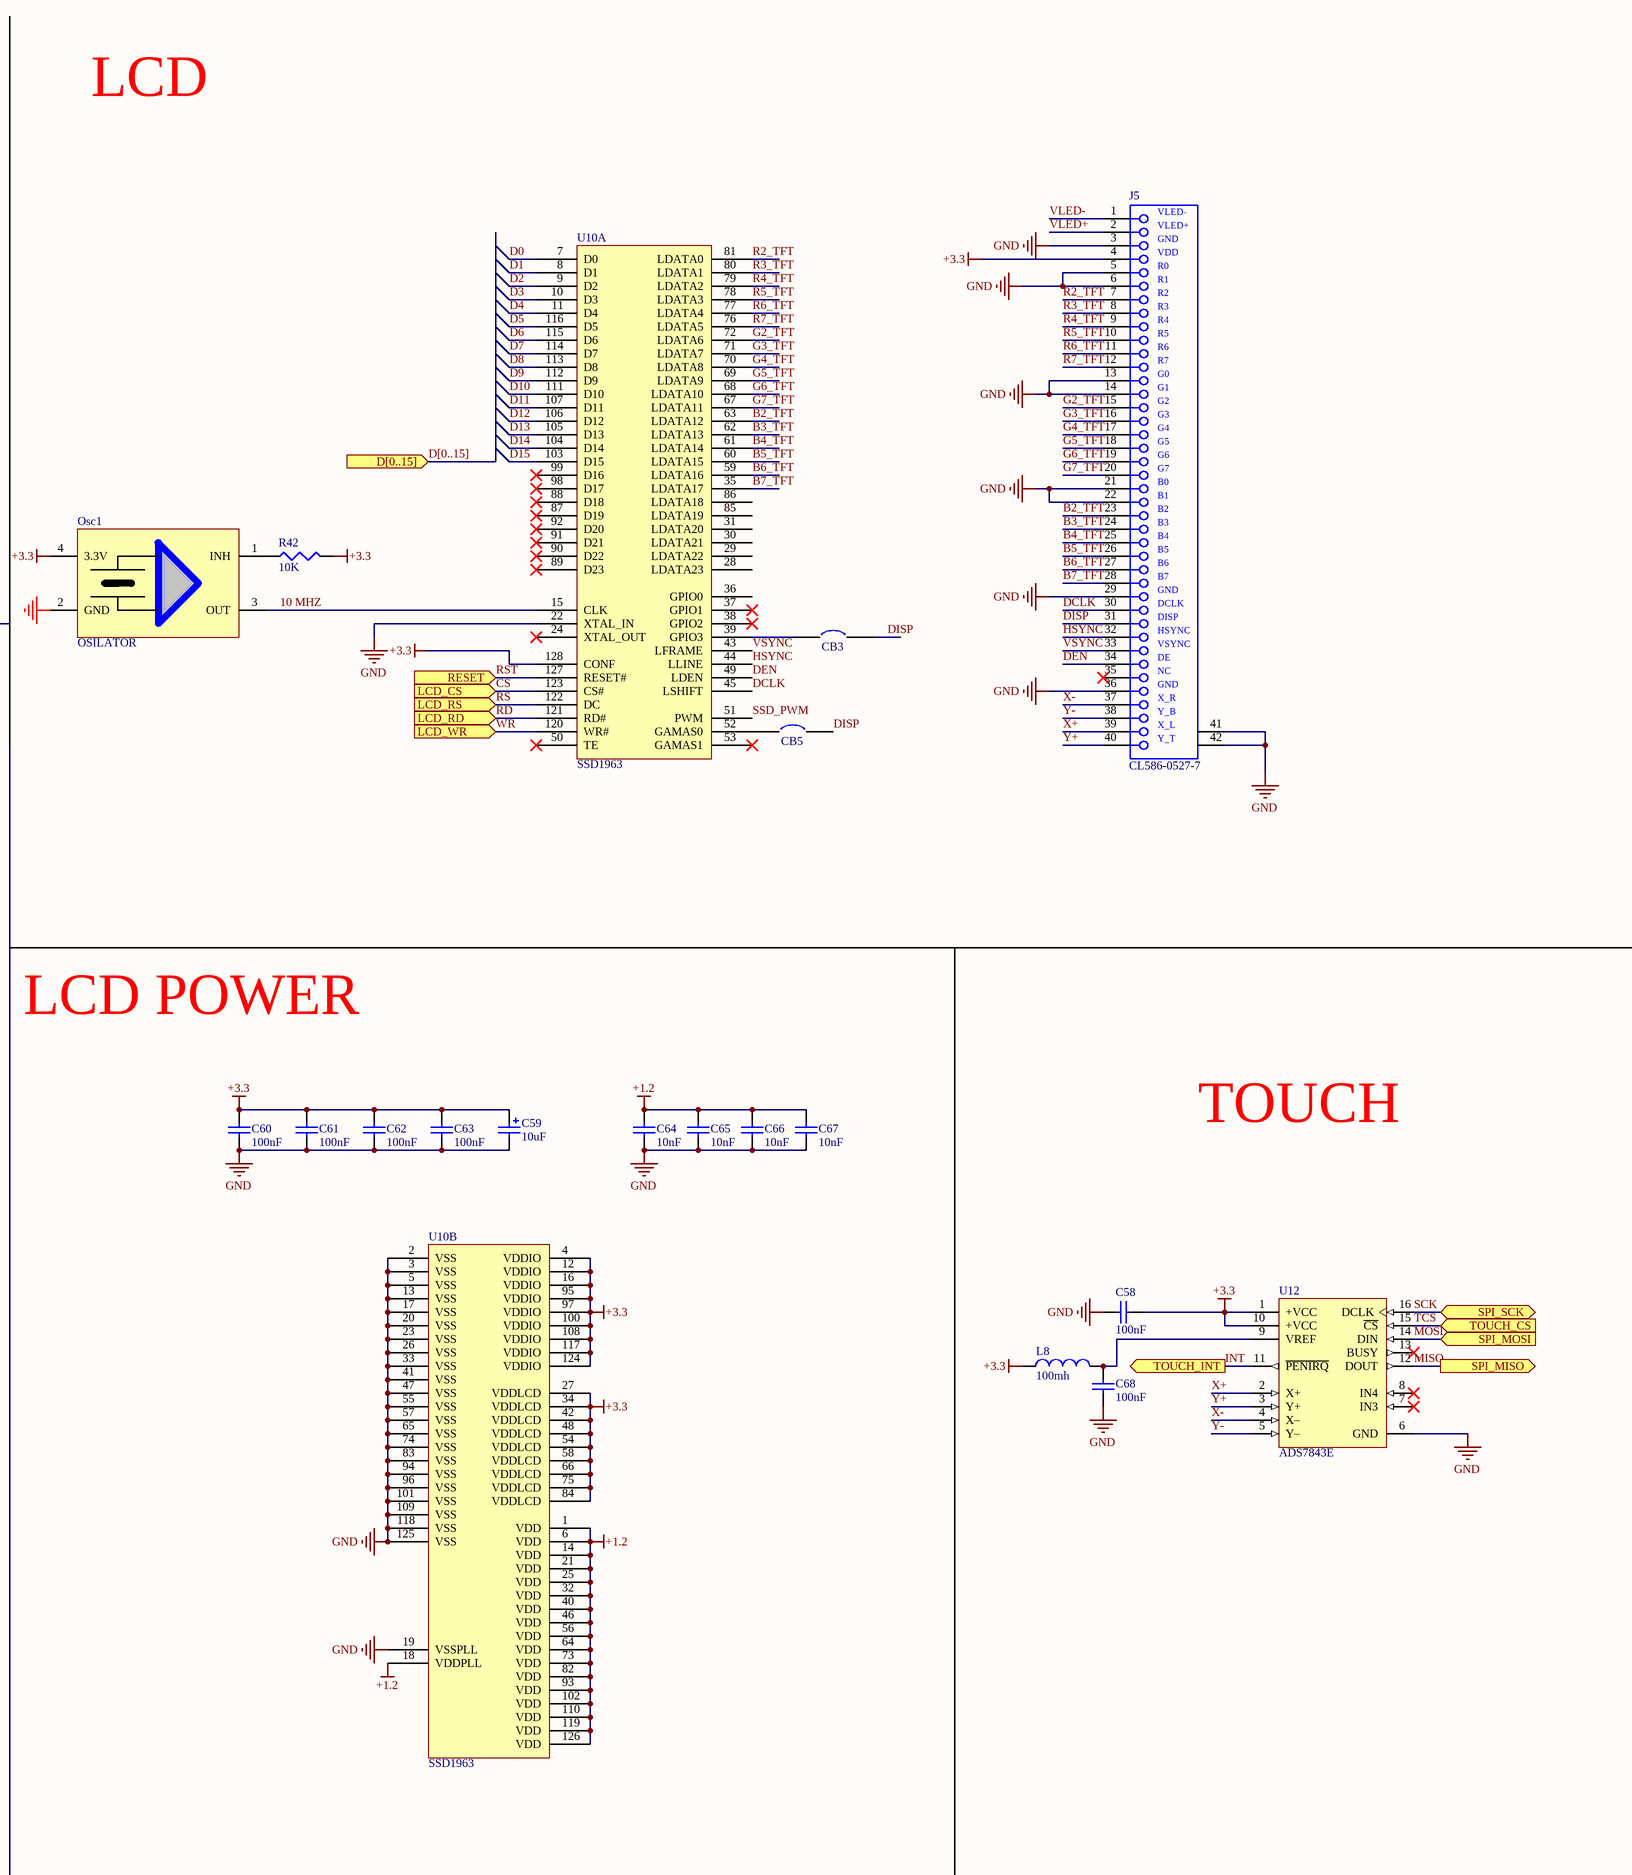
[diagram p7: LCD.SchDoc, right]

### Parts
C1  10uF/50V  [CAP1050]
C48  200pF  [1206]
C49  10uF  [CAP1016]
C58  100nF  [1206]
C59  10uF  [CAP1016]
C60  100nF  [0805]
C61  100nF  [0805]
C62  100nF  [0805]
C63  100nF  [0805]
C64  10nF  [0805]
C65  10nF  [0805]
C66  10nF  [0805]
C67  10nF  [0805]
C68  100nF  [1206]
CB1  JUMPER  [0805]  (value not drawn)
CB2  JUMPER  [0805]  (value not drawn)
CB3  JUMPER  [0805]  (value not drawn)
CB4  JUMPER  [0805]  (value not drawn)
CB5  JUMPER  [0805]  (value not drawn)
D3  SS14  [1N4007]
D10  ZENER 28V  [1N4007]
J5  CL586-0527-7  [FH40SB]
L6  100uH 500mA  [Inductorsmd]
L8  100mh  [L1206]
Osc1  OSILATOR  [XTAL_5X7]
R40  1K  [1206]
R41  80  [1206]
R42  10K  [1206]
U9  TPS61040  [SOT-23-5L]
U10  SSD1963  [LQFP128_M]  (parts A,B of 2)
U12  ADS7843E  [DBQ016]

### Ports
D[0..15] (in), LCD_CS (in), LCD_PWM (in), LCD_RD (in), LCD_RS (in), LCD_WR (in), RESET (in), SPI_MISO (out), SPI_MOSI (in), SPI_SCK (bidir), TOUCH_CS (in), TOUCH_INT (out)

### Nets
+1.2: C64.1 C65.1 C66.1 C67.1 U10.1(VDD) U10.6(VDD) U10.14(VDD) U10.18(VDDPLL) U10.21(VDD) U10.25(VDD) U10.32(VDD) U10.40(VDD) U10.46(VDD) U10.56(VDD) U10.64(VDD) U10.73(VDD) U10.82(VDD) U10.93(VDD) U10.102(VDD) U10.110(VDD) U10.119(VDD) U10.126(VDD)
+3.3: C58.2 C59.1 C60.1 C61.1 C62.1 C63.1 J5.4 L8.1 Osc1.4(3.3V) R42.2 U10.4(VDDIO) U10.12(VDDIO) U10.16(VDDIO) U10.27(VDDLCD) U10.34(VDDLCD) U10.42(VDDLCD) U10.48(VDDLCD) U10.54(VDDLCD) U10.58(VDDLCD) U10.66(VDDLCD) U10.75(VDDLCD) U10.84(VDDLCD) U10.95(VDDIO) U10.97(VDDIO) U10.100(VDDIO) U10.108(VDDIO) U10.117(VDDIO) U10.124(VDDIO) U10.128(CONF) U12.1(+VCC) U12.10(+VCC)
+5A: C49.1 CB1.1 L6.1 U9.5(VIN)
GND: C1.2 C48.1 C49.2 C58.1 C59.2 C60.2 C61.2 C62.2 C63.2 C64.2 C65.2 C66.2 C67.2 C68.1 D10.1(A) J5.3 J5.5 J5.6 J5.13 J5.14 J5.21 J5.22 J5.29 J5.36 J5.41(MH1) J5.42(MH2) Osc1.2(GND) R41.1 U9.2(GND) U10.2(VSS) U10.3(VSS) U10.5(VSS) U10.13(VSS) U10.17(VSS) U10.19(VSSPLL) U10.20(VSS) U10.22(XTAL_IN) U10.23(VSS) U10.26(VSS) U10.33(VSS) U10.41(VSS) U10.47(VSS) U10.55(VSS) U10.57(VSS) U10.65(VSS) U10.74(VSS) U10.83(VSS) U10.94(VSS) U10.96(VSS) U10.101(VSS) U10.109(VSS) U10.118(VSS) U10.125(VSS) U12.6(GND)
10 MHZ: Osc1.3(OUT) U10.15(CLK)
B2_TFT: J5.23 U10.63(LDATA12)
B3_TFT: J5.24 U10.62(LDATA13)
B4_TFT: J5.25 U10.61(LDATA14)
B5_TFT: J5.26 U10.60(LDATA15)
B6_TFT: J5.27 U10.59(LDATA16)
B7_TFT: J5.28 U10.35(LDATA17)
CS: U10.123(CS#) ; port LCD_CS
D0: U10.7(D0)
D1: U10.8(D1)
D2: U10.9(D2)
D3: U10.10(D3)
D4: U10.11(D4)
D5: U10.116(D5)
D6: U10.115(D6)
D7: U10.114(D7)
D8: U10.113(D8)
D9: U10.112(D9)
D10: U10.111(D10)
D11: U10.107(D11)
D12: U10.106(D12)
D13: U10.105(D13)
D14: U10.104(D14)
D15: U10.103(D15)
DCLK: J5.30 U10.45(LSHIFT)
DEN: J5.34 U10.49(LDEN)
DISP: CB3.2 CB5.2 J5.31
G2_TFT: J5.15 U10.72(LDATA6)
G3_TFT: J5.16 U10.71(LDATA7)
G4_TFT: J5.17 U10.70(LDATA8)
G5_TFT: J5.18 U10.69(LDATA9)
G6_TFT: J5.19 U10.68(LDATA10)
G7_TFT: J5.20 U10.67(LDATA11)
HSYNC: J5.32 U10.44(LLINE)
INT: U12.11(~{PENIRQ}) ; port TOUCH_INT
MISO: U12.12(DOUT) ; port SPI_MISO
MOSI: U12.14(DIN) ; port SPI_MOSI
PWM: CB4.1 ; port LCD_PWM  [project net PD12]
R2_TFT: J5.7 U10.81(LDATA0)
R3_TFT: J5.8 U10.80(LDATA1)
R4_TFT: J5.9 U10.79(LDATA2)
R5_TFT: J5.10 U10.78(LDATA3)
R6_TFT: J5.11 U10.77(LDATA4)
R7_TFT: J5.12 U10.76(LDATA5)
RD: U10.121(RD#) ; port LCD_RD  [project net PD4]
RS: U10.122(DC) ; port LCD_RS  [project net PD11]
RST: U10.127(RESET#) ; port RESET  [project net RESET]
SCK: U12.16(DCLK) ; port SPI_SCK  [project net PB13]
SSD_PWM: CB2.1 U10.51(PWM)
TCS: U12.15(~{CS}) ; port TOUCH_CS  [project net PB2]
VLED+: C1.1 D3.2(K) D10.2(K) J5.2
VLED-: J5.1 R40.2 R41.2
VSYNC: J5.33 U10.43(LFRAME)
WR: U10.120(WR#) ; port LCD_WR  [project net PD5]
X+: J5.39 U12.2(X+)
X-: J5.37 U12.4(X–)
Y+: J5.40 U12.3(Y+)
Y-: J5.38 U12.5(Y–)
NetC48_2: C48.2 R40.1 U9.3(FB)
NetC68_2: C68.2 L8.2 U12.9(VREF)
NetCB1_2: CB1.2 CB2.2 CB4.2 U9.4(E)
NetCB3_1: CB3.1 U10.39(GPIO3)
NetCB5_1: CB5.1 U10.52(GAMAS0)
NetD3_1: D3.1(A) L6.2 U9.1(SW)
NetOsc1_1: Osc1.1(INH) R42.1

Not connected (* = marked no-connect by the designer): J5 35*; U10 24(XTAL_OUT)* 28(LDATA23) 29(LDATA22) 30(LDATA21) 31(LDATA20) 36(GPIO0) 37(GPIO1)* 38(GPIO2)* 50(TE)* 53(GAMAS1)* 85(LDATA19) 86(LDATA18) 87(D19)* 88(D18)* 89(D23)* 90(D22)* 91(D21)* 92(D20)* 98(D17)* 99(D16)*; U12 7(IN3)* 8(IN4)* 13(BUSY)*

### Buses and harness runs
bus D[0..15] = port D[0..15]

### Notes on the sheet
- BACKLIGHT
- LCD
- LCD POWER
- TOUCH
- (in symbol CL586-0527-7) VLED-; VLED+; GND; VDD; R0; R1; R2; R3; R4; R5; R6; R7; G0; G1; G2; G3; G4; G5; G6; G7; B0; B1; B2; B3; B4; B5; B6; B7; DCLK; DISP; HSYNC; VSYNC; DE; NC; X_R; Y_B; X_L; Y_T

### Library data of the parts
C1 C49 = Cap Pol1: Polarized Capacitor (Radial); Value: 100pF; Published: 8-Jun-2000; LatestRevisionDate: 17-Jul-2002; LatestRevisionNote: Re-released for DXP Platform.; PackageReference: RB7.6-15; Publisher: Altium Limited
C48 = Cap Semi: Capacitor (Semiconductor SIM Model); Value: 100pF; Published: 8-Jun-2000; LatestRevisionDate: 29-May-2009; LatestRevisionNote: IPC-7351 Footprint Added.; PackageReference: C1206; Publisher: Altium Limited; PackageDescription: Chip Capacitor
C58 C60-C63 C68 = Cap: Capacitor; Published: 8-Jun-2000; Revision: July-2002: Re-released for DXP Platform.; Publisher: Altium Limited; Value: 100nF
C59 = Cap Pol1: Polarized Capacitor (Radial); Published: 8-Jun-2000; Revision: July-2002: Re-released for DXP Platform.; Publisher: Altium Limited; Value: 10uF
C64-C67 = Cap: Capacitor; Value: 100nF; Published: 8-Jun-2000; Revision: July-2002: Re-released for DXP Platform.; Publisher: Altium Limited
CB1-CB5 = Circuit Breaker: Published: 24-Mar-1999; LatestRevisionDate: 17-Jul-2002; LatestRevisionNote: Re-released for DXP Platform.; PackageReference: SPST-2; Publisher: Altium Limited
D3 D10 = D Schottky: Schottky Diode; Published: 8-Jun-2000; LatestRevisionDate: 17-Jul-2002; LatestRevisionNote: Re-released for DXP Platform.; PackageReference: SMB; Publisher: Altium Limited; Code_JEDEC: DO-214-AA
J5 = CL586-0527-7: FH12 Series, "Flip-Lock" SMT/ZIF FFC/FPC Connector - 0.5mm Spaced Bottom Contact; Positions: 40; ContactMaterial: Phosphor Bronze; Current: 0.4A; PCB_Layout: Complies with manufacturer's recommendation.; Published: 17-Jul-2002; DatasheetVersion: 13-Nov-2000; PackageVersion: 13-Nov-2000; PackageReference: FH12-40S-0.5SH; Publisher: Altium Limited; PadDimensions: Follow nominal values, Suitable for Wave Soldering, Adjust for Re-flow.; ComponentLink1Description: Manufacturer Link; ComponentLink1URL: http://www.hiroseusa.com/; ComponentLink2Description: Datasheet; ComponentLink2URL: http://www.hirose.co.jp/cataloge_hp/e58605370.pdf
L6 L8 = Inductor: Code_IEC: 1005; Value: 10mH; Published: 8-Jun-2000; LatestRevisionDate: 29-May-2009; LatestRevisionNote: IPC-7351 Footprint Added.; PackageReference: 0402-A; Publisher: Altium Limited; PackageDescription: Chip Inductor; Code_JEITA: 0402
R40 R41 = Res1: Resistor; Value: 10K; Published: 8-Jun-2000; LatestRevisionDate: 17-Jul-2002; LatestRevisionNote: Re-released for DXP Platform.; PackageReference: AXIAL-0.3; Publisher: Altium Limited
R42 = Res3: Resistor; Value: 1K; Published: 8-Jun-2000; LatestRevisionDate: 04-Mar-2005; LatestRevisionNote: PCB Footprint replaced.; PackageReference: J1-0603; Publisher: Altium Limited
U9 = TPS61040: Backlight Regulagtor
U12 = ADS7843E: 4-Wire Touch Screen Controller, 16-Pin SSOP, Pb-Free; Published: 6-Oct-2005; DatasheetVersion: May-2002; PackageVersion: Feb-2005; PackageReference: DBQ016; Publisher: Altium Limited; PackageDescription: SSOP; 16 Leads; Body Width 3.9 mm; Pitch 0.635 mm; Code_JEDEC: MO-137-AB; ComponentLink1Description: Manufacturer Link; ComponentLink1URL: http://focus.ti.com/docs/prod/folders/print/ads7843.html; ComponentLink2Description: Datasheet; ComponentLink2URL: http://focus.ti.com/lit/ds/symlink/ads7843.pdf

## Nets that join several sheets
+1.2: Power (C46.1 VR3.4), LCD (22 pins)
+3.3: MCU (13 pins), Power (7 pins), Conncetors (19 pins), Interface (C21.1 U6.5 U6.6), LCD (31 pins)
+5: Power (9 pins), Conncetors (7 pins), Interface (8 pins)
+5A: Power (C7.1 VR4.4), LCD (C49.1 CB1.1 L6.1 U9.5)
GND: MCU (22 pins), Power (20 pins), Conncetors (17 pins), Interface (25 pins), UserInterface (5 pins), LCD (54 pins)
CS: MCU (U7.88), LCD (U10.123)
D0: MCU (U7.61), LCD (U10.7)
D1: MCU (U7.62), LCD (U10.8)
D2: MCU (U7.81), LCD (U10.9)
D3: MCU (U7.82), LCD (U10.10)
D4: MCU (U7.38), LCD (U10.11)
D5: MCU (U7.39), LCD (U10.116)
D6: MCU (U7.40), LCD (U10.115)
D7: MCU (U7.41), LCD (U10.114)
D8: MCU (U7.42), LCD (U10.113)
D9: MCU (U7.43), LCD (U10.112)
D10: MCU (U7.44), LCD (U10.111)
D11: MCU (U7.45), LCD (U10.107)
D12: MCU (U7.46), LCD (U10.106)
D13: MCU (U7.55), LCD (U10.105)
D14: MCU (U7.56), LCD (U10.104)
D15: MCU (U7.57), LCD (U10.103)
INT: MCU (U7.60), LCD (U12.11)
MISO: MCU (U7.53), Conncetors (P5.6), Interface (U6.8), LCD (U12.12)
MOSI: MCU (U7.54), Conncetors (P5.8), Interface (U6.1), LCD (U12.14)
PA0: MCU (U7.23), Conncetors (P5.11), Interface (U2.9)
PA1: MCU (U7.24), Conncetors (P5.9), Interface (R13.2 U2.10)
PA2: MCU (U7.25), Conncetors (P5.7), Interface (R14.2 U2.11)
PA3: MCU (U7.26), Conncetors (P5.5), Interface (U2.12)
PA4: MCU (U7.29), Conncetors (P4.1)
PA5: MCU (U7.30), Conncetors (P4.2)
PA6: MCU (U7.31), Conncetors (P4.3)
PA7: MCU (U7.32), Conncetors (P4.5)
PA8: MCU (U7.67), Conncetors (R129.1)
PA9: MCU (U7.68), Interface (U4.5)
PA10: MCU (U7.69), Interface (U4.1)
PA11: MCU (U7.70), Conncetors (R10.1)
PA12: MCU (U7.71), Conncetors (R9.1)
PA13: MCU (U7.72), Conncetors (P1.7 R3.1)
PA14: MCU (U7.76), Conncetors (P1.9 R4.1)
PA15: MCU (U7.77), Conncetors (P1.5 R2.1)
PB0: MCU (U7.35), Conncetors (P4.7)
PB1: MCU (U7.36), Conncetors (P4.9)
PB2: MCU (k2.1 U7.37), LCD (U12.15)
PB3: MCU (U7.89), Conncetors (P1.13)
PB4: MCU (U7.90), Conncetors (P1.3 R1.1)
PB5: MCU (U7.91), Conncetors (P5.20)
PB6: MCU (U7.92), Conncetors (P5.15)
PB7: MCU (U7.93), Conncetors (P5.13)
PB8: MCU (U7.95), Conncetors (P5.2)
PB9: MCU (U7.96), Conncetors (P5.4)
PB10: MCU (U7.47), Conncetors (P5.1)
PB11: MCU (U7.48), Conncetors (P5.3)
PB12: MCU (U7.51), Interface (U6.4)
PB13: MCU (U7.52), Conncetors (P5.10), Interface (U6.2), LCD (U12.16)
PC0: MCU (U7.15), Conncetors (P4.4)
PC1: MCU (U7.16), Conncetors (P4.6)
PC2: MCU (U7.17), Conncetors (P4.8)
PC3: MCU (U7.18), Conncetors (P4.10)
PC4: MCU (U7.33), Conncetors (P4.12)
PC6: MCU (U7.63), Conncetors (P5.16)
PC7: MCU (U7.64), Conncetors (P5.18)
PC8: MCU (U7.65), Conncetors (CN13.7 R130.2)
PC9: MCU (U7.66), Conncetors (CN13.8 R131.2)
PC10: MCU (U7.78), Conncetors (CN13.1 R132.2)
PC11: MCU (U7.79), Conncetors (CN13.2 R133.2)
PC12: MCU (U7.80), Conncetors (CN13.5)
PC13: MCU (U7.7), Conncetors (P2.7), UserInterface (R35.1)
PD2: MCU (U7.83), Conncetors (CN13.3 R134.2)
PD3: MCU (U7.84), Conncetors (P5.12)
PD4: MCU (U7.85), LCD (U10.121)
PD5: MCU (U7.86), LCD (U10.120)
PD6: MCU (U7.87), Conncetors (P5.14)
PD11: MCU (U7.58), LCD (U10.122)
PD12: MCU (U7.59), LCD (CB4.1)
PE0: MCU (U7.97), Conncetors (P2.2), UserInterface (R30.1)
PE1: MCU (U7.98), Conncetors (P2.4), UserInterface (R31.1)
PE2: MCU (U7.1), Conncetors (P2.6), UserInterface (R32.1)
PE3: MCU (U7.2), Conncetors (P2.8), UserInterface (R33.1)
PE4: MCU (U7.3), Conncetors (P2.1)
PE5: MCU (U7.4), Conncetors (P2.3)
PE6: MCU (U7.5), Conncetors (P2.5)
RESET: MCU (C34.2 R25.2 S6.2 U7.14), Conncetors (P1.15), Interface (U6.3), LCD (U10.127)